# Altium project AMC_FMC_Carrier.PrjPcb (part 8 of 9)

## Sheet AMC-SATA.SchDoc
size A4; DocumentNumber: 25; SheetNumber: 25; SheetTotal: 30
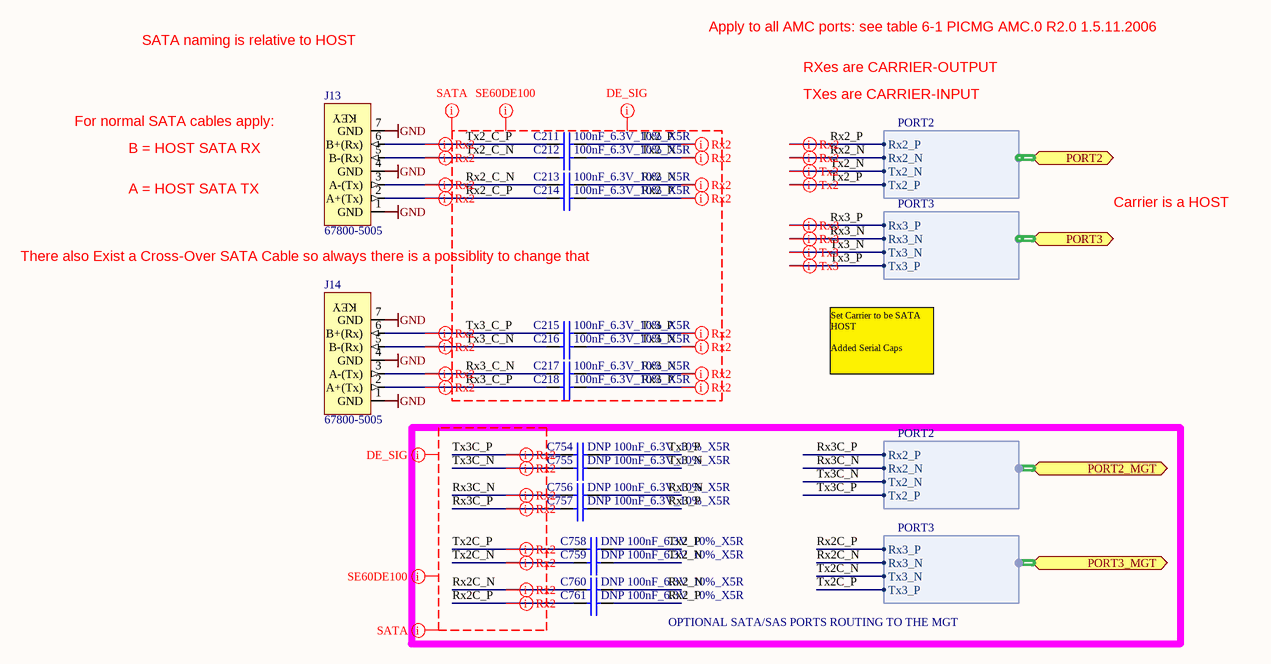
[diagram p20: AMC-SATA.SchDoc]

### Parts
C211  100nF_6.3V_10%_X5R  [0201C]
C212  100nF_6.3V_10%_X5R  [0201C]
C213  100nF_6.3V_10%_X5R  [0201C]
C214  100nF_6.3V_10%_X5R  [0201C]
C215  100nF_6.3V_10%_X5R  [0201C]
C216  100nF_6.3V_10%_X5R  [0201C]
C217  100nF_6.3V_10%_X5R  [0201C]
C218  100nF_6.3V_10%_X5R  [0201C]
C754  DNP 100nF_6.3V_10%_X5R  [0201C]
C755  DNP 100nF_6.3V_10%_X5R  [0201C]
C756  DNP 100nF_6.3V_10%_X5R  [0201C]
C757  DNP 100nF_6.3V_10%_X5R  [0201C]
C758  DNP 100nF_6.3V_10%_X5R  [0201C]
C759  DNP 100nF_6.3V_10%_X5R  [0201C]
C760  DNP 100nF_6.3V_10%_X5R  [0201C]
C761  DNP 100nF_6.3V_10%_X5R  [0201C]
J13  67800-5005  [CON_SATA_V]
J14  67800-5005  [CON_SATA_V]

### Blocks framed on the sheet
OPTIONAL SATA/SAS PORTS ROUTING TO THE MGT: C754-C761

### Ports
PORT2 (harness PORT2), PORT2_MGT (harness PORT2), PORT3 (harness PORT3), PORT3_MGT (harness PORT3)

### Harnesses
PORT2: Rx2_P, Rx2_N, Tx2_N, Tx2_P
PORT3: Rx3_P, Rx3_N, Tx3_N, Tx3_P

### Nets
GND: J13.1(GND) J13.4(GND) J13.7(GND) J14.1(GND) J14.4(GND) J14.7(GND)
Rx2_C_N: C213.1 J13.3(A-(Tx))
Rx2_C_P: C214.1 J13.2(A+(Tx))
Rx2_N: C213.2 C760.2 ; port PORT2.Rx2_N  [project net PORT2.Rx2_N]
Rx2_P: C214.2 C761.2 ; port PORT2.Rx2_P  [project net PORT2.Rx2_P]
Rx2C_N: C760.1 ; port PORT3_MGT.Rx3_N
Rx2C_P: C761.1 ; port PORT3_MGT.Rx3_P
Rx3_C_N: C217.1 J14.3(A-(Tx))
Rx3_C_P: C218.1 J14.2(A+(Tx))
Rx3_N: C217.2 C756.2 ; port PORT3.Rx3_N  [project net PORT3.Rx3_N]
Rx3_P: C218.2 C757.2 ; port PORT3.Rx3_P  [project net PORT3.Rx3_P]
Rx3C_N: C756.1 ; port PORT2_MGT.Rx2_N
Rx3C_P: C757.1 ; port PORT2_MGT.Rx2_P
Tx2_C_N: C212.1 J13.5(B-(Rx))
Tx2_C_P: C211.1 J13.6(B+(Rx))
Tx2_N: C212.2 C759.2 ; port PORT2.Tx2_N  [project net PORT2.Tx2_N]
Tx2_P: C211.2 C758.2 ; port PORT2.Tx2_P  [project net PORT2.Tx2_P]
Tx2C_N: C759.1 ; port PORT3_MGT.Tx3_N
Tx2C_P: C758.1 ; port PORT3_MGT.Tx3_P
Tx3_C_N: C216.1 J14.5(B-(Rx))
Tx3_C_P: C215.1 J14.6(B+(Rx))
Tx3_N: C216.2 C755.2 ; port PORT3.Tx3_N  [project net PORT3.Tx3_N]
Tx3_P: C215.2 C754.2 ; port PORT3.Tx3_P  [project net PORT3.Tx3_P]
Tx3C_N: C755.1 ; port PORT2_MGT.Tx2_N
Tx3C_P: C754.1 ; port PORT2_MGT.Tx2_P

### Layout directives
differential pair: PORT2.Rx2_N, PORT2.Rx2_P, PORT2.Tx2_N, PORT2.Tx2_P, PORT3.Rx3_N, PORT3.Rx3_P, PORT3.Tx3_N, PORT3.Tx3_P, Rx2_C_N, Rx2_C_P, Rx2C_N, Rx2C_P, Rx3_C_N, Rx3_C_P, Rx3C_N, Rx3C_P, Tx2_C_N, Tx2_C_P, Tx2C_N, Tx2C_P, Tx3_C_N, Tx3_C_P, Tx3C_N, Tx3C_P
net class SATA: Rx2_C_N, Rx2_C_P, Rx2_N, Rx2_P, Rx2C_N, Rx2C_P, Rx3_C_N, Rx3_C_P, Rx3_N, Rx3_P, Rx3C_N, Rx3C_P, Tx2_C_N, Tx2_C_P, Tx2_N, Tx2_P, Tx2C_N, Tx2C_P, Tx3_C_N, Tx3_C_P, Tx3_N, Tx3_P, Tx3C_N, Tx3C_P
net class SE60DE100: Rx2_C_N, Rx2_C_P, Rx2_N, Rx2_P, Rx2C_N, Rx2C_P, Rx3_C_N, Rx3_C_P, Rx3_N, Rx3_P, Rx3C_N, Rx3C_P, Tx2_C_N, Tx2_C_P, Tx2_N, Tx2_P, Tx2C_N, Tx2C_P, Tx3_C_N, Tx3_C_P, Tx3_N, Tx3_P, Tx3C_N, Tx3C_P
net class DE_SIG: Rx2_C_N, Rx2_C_P, Rx2_N, Rx2_P, Rx2C_N, Rx2C_P, Rx3_C_N, Rx3_C_P, Rx3_N, Rx3_P, Rx3C_N, Rx3C_P, Tx2_C_N, Tx2_C_P, Tx2_N, Tx2_P, Tx2C_N, Tx2C_P, Tx3_C_N, Tx3_C_P, Tx3_N, Tx3_P, Tx3C_N, Tx3C_P

### Notes on the sheet
- SATA naming is relative to HOST
- Apply to all AMC ports: see table 6-1 PICMG AMC.0 R2.0 1.5.11.2006
- RXes are CARRIER-OUTPUT
- For normal SATA cables apply:
- B = HOST SATA RX
- TXes are CARRIER-INPUT
- A = HOST SATA TX
- Carrier is a HOST
- There also Exist a Cross-Over SATA Cable so always there is a possiblity to change that
- Set Carrier to be SATA HOST
  Added Serial Caps
- (in symbol CON_SATA_V) KEY

### Library data of the parts
C211-C218 C754-C761 = CAP_SMD_0201: Capacitor SMD
J13 J14 = CON_SATA_V: SATA conenctor  PCB Molex

## Sheet block schematic.SchDoc
size A4; DocumentNumber: 15; SheetNumber: 15; SheetTotal: 30
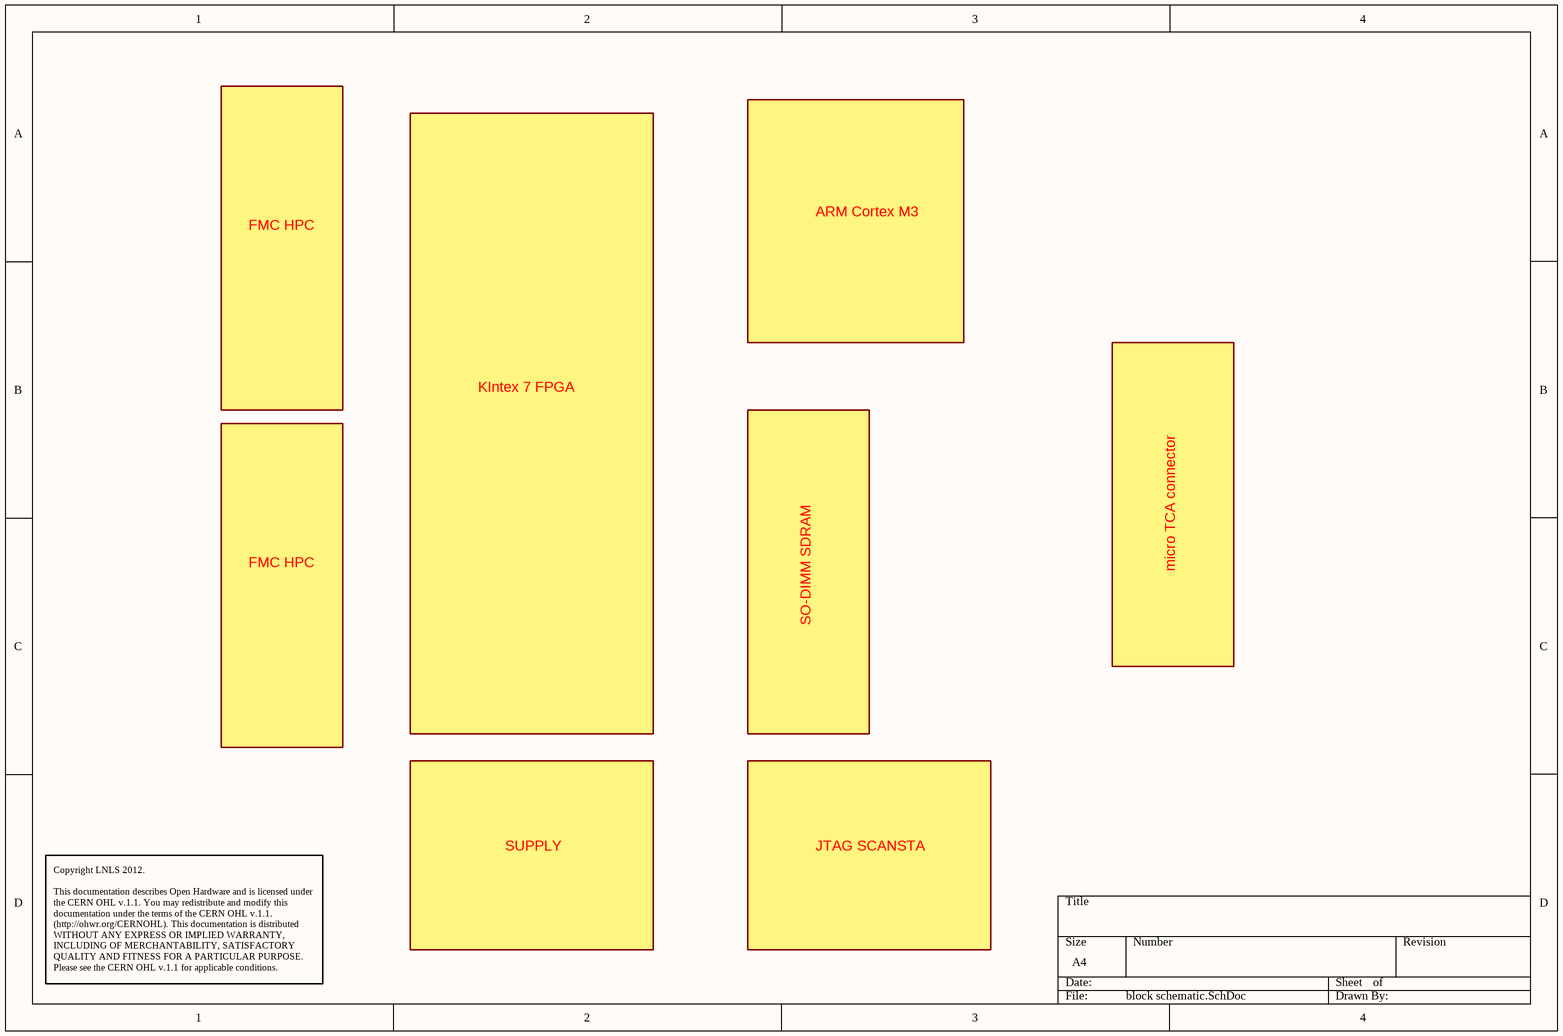
[diagram p21: block schematic.SchDoc]

### Notes on the sheet
- FMC HPC
- ARM Cortex M3
- KIntex 7 FPGA
- micro TCA connector
- SO-DIMM SDRAM
- SUPPLY
- JTAG SCANSTA
- Copyright LNLS 2012.
  This documentation describes Open Hardware and is licensed under the CERN OHL v.1.1. You may redistribute and modify this documentation under the terms of the CERN OHL v.1.1. (http://ohwr.org/CERNOHL). This documentation is distributed WITHOUT ANY EXPRESS OR IMPLIED WARRANTY, INCLUDING OF MERCHANTABILITY, SATISFACTORY QUALITY AND FITNESS FOR A PARTICULAR PURPOSE. Please see the CERN OHL v.1.1 for applicable conditions.

## Sheet HeightRuleRoom1.9mm.SchDoc
size A4
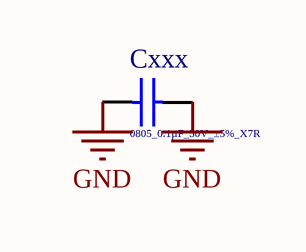
[diagram p22: HeightRuleRoom1.9mm.SchDoc]

### Parts
Cxxx  0805_0.1µF_50V_±5%_X7R  [CAPC2012X140N]

### Nets
GND: Cxxx.1 Cxxx.2

### Library data of the parts
Cxxx = 08055C104JAT2A: CAP CER 0.1UF 50V 5% X7R 0805; Manufacturer: AVX Corporation; Capacitance: 0.1µF; Document Name: HeightRuleRoom1.9mm.SchDoc; Part Number: 08055C104JAT2A; ParamsList: 0805_0.1µF_50V_±5%_X7R; Supplier 1: Digi-Key; Supplier Part Number 1: 478-3352-1-ND; Manufacturer Part Number: 08055C104JAT2A; RoHS: RoHS Compliant; Category: Capacitors; Stock 1: 277543; Pricing 1: 1=0.15, 10=0.1, 100=0.0475, 250=0.04, 500=0.0335, 1000=0.0275 (USD); Voltage - Rated: 50V; Tolerance: ±5%; Temperature Coefficient: X7R; Mounting Type: Surface Mount, MLCC; Operating Temperature: -55°C ~ 125°C; Applications: General Purpose; Ratings: -; Package / Case: 0805 (2012 Metric); Size / Dimension: 0.079" L x 0.049" W (2.01mm x 1.25mm); Height - Seated (Max): -; Thickness (Max): 0.055" (1.40mm); Lead Spacing: -; Features: -; Packaging: Cut Tape (CT); Lead Style: -; ComponentLink1URL: http://www.avx.com/docs/Catalogs/cx7r.pdf; ComponentLink1Description: http://www.avx.com/docs/Catalogs/cx7r.pdf; FootprintSizeX (mm): 3.5; FootprintSizeY (mm): 2; FootprintRectangleArea (mm): 7; Thickness (Max) (mm): 1.4; FootprintAlias: 0805

## Sheet SUP_1.2_1.8.SchDoc
size A4; DocumentNumber: 6; SheetNumber: 6; SheetTotal: 30
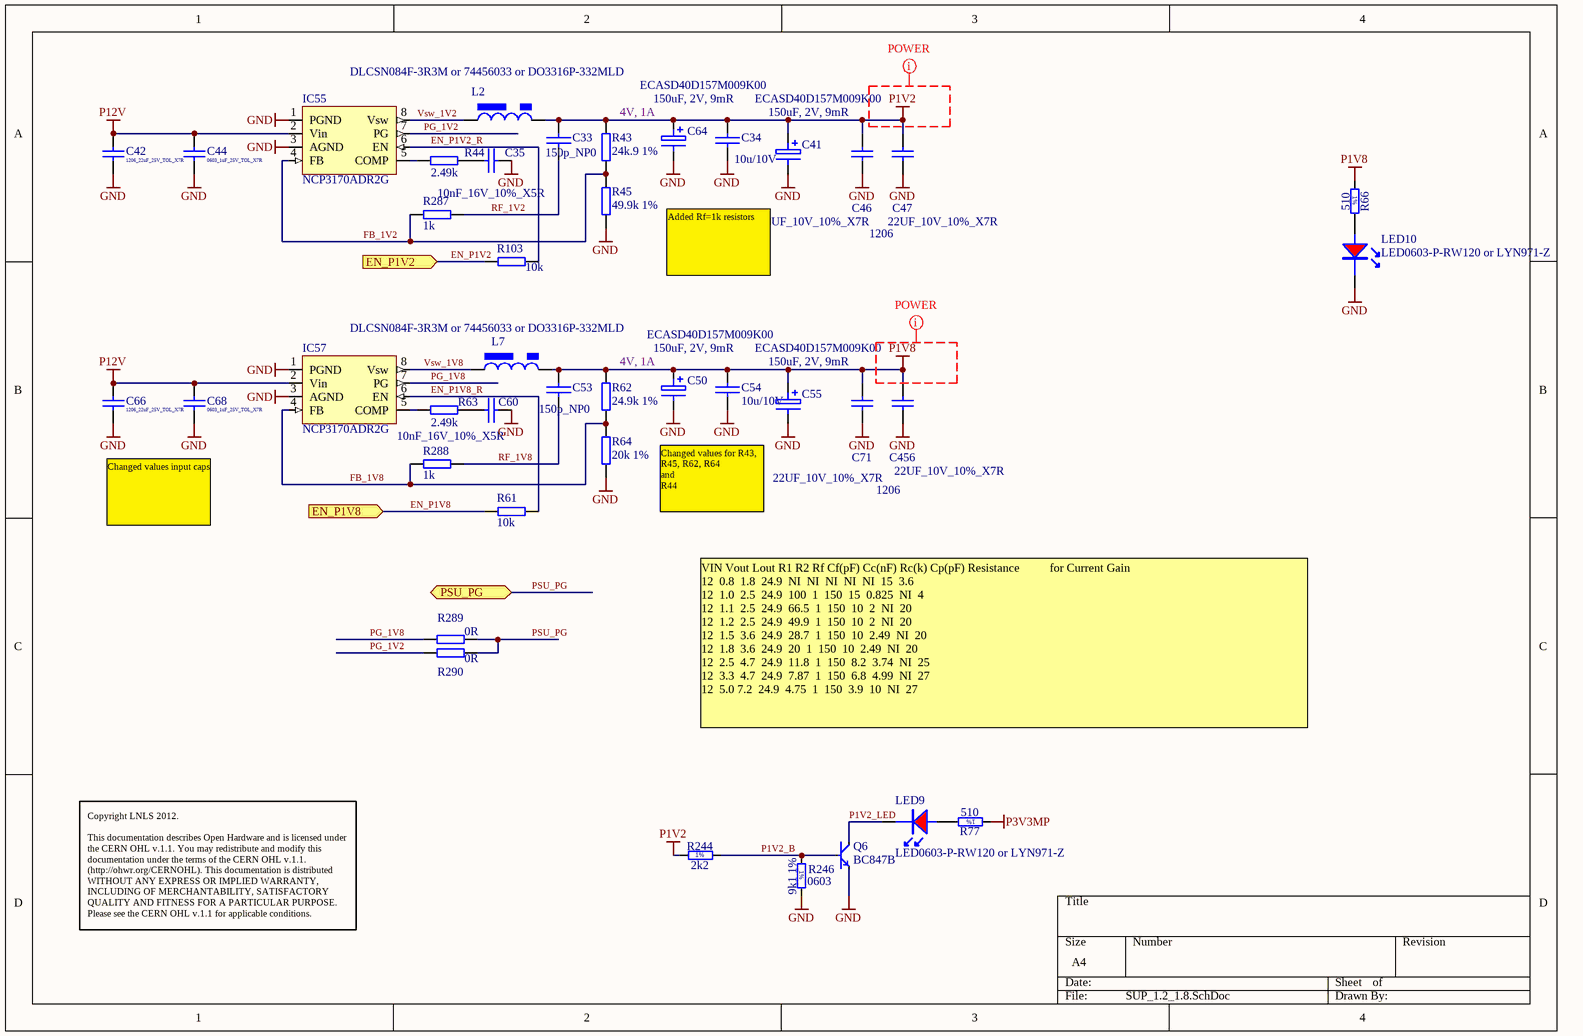
[diagram p23: SUP_1.2_1.8.SchDoc]

### Parts
C33  150p_NP0  [0603C]
C34  10u/10V  [0805C]
C35  10nF_16V_10%_X5R  [0603C]
C41  ECASD40D157M009K00  value 150uF, 2V, 9mR  [2917_POLY]
C42  1206_22uF_25V_TOL_X7R  [CAPC3225X140N]
C44  0603_1uF_25V_TOL_X7R  [CAPC1608X90N]
C46  22UF_10V_10%_X7R  [1206C]
C47  22UF_10V_10%_X7R  Case: 1206  [1206C]
C50  ECASD40D157M009K00  value 150uF, 2V, 9mR  [2917_POLY]
C53  150p_NP0  [0603C]
C54  10u/10V  [0805C]
C55  ECASD40D157M009K00  value 150uF, 2V, 9mR  [2917_POLY]
C60  10nF_16V_10%_X5R  [0603C]
C64  ECASD40D157M009K00  value 150uF, 2V, 9mR  [2917_POLY]
C66  1206_22uF_25V_TOL_X7R  [CAPC3225X140N]
C68  0603_1uF_25V_TOL_X7R  [CAPC1608X90N]
C71  22UF_10V_10%_X7R  [1206C]
C456  22UF_10V_10%_X7R  Case: 1206  [1206C]
IC55  NCP3170ADR2G  [so-8]
IC57  NCP3170ADR2G  [so-8]
L2  DLCSN084F-3R3M or 74456033 or DO3316P-332MLD  [IND_CSN084F]
L7  DLCSN084F-3R3M or 74456033 or DO3316P-332MLD  [IND_CSN084F]
LED9  LED0603-P-RW120 or LYN971-Z  [led_0603R]
LED10  LED0603-P-RW120 or LYN971-Z  [led_0603R]
Q6  BC847B  [SOT-23]
R43  24k.9 1%  [0603R]
R44  2.49k  [0603R]
R45  49.9k 1%  [0603R]
R61  10k  [0402R]
R62  24.9k 1%  [0603R]
R63  2.49k  [0603R]
R64  20k 1%  [0603R]
R66  510  [0603R]
R77  510  [0603R]
R103  10k  [0402R]
R244  2k2  [RESC1608X55N]
R246  9k1 1%  Case: 0603  [0603R]
R287  1k  [0603R]
R288  1k  [0603R]
R289  0R  [0402R]
R290  0R  [0402R]

### Ports
EN_P1V2 (in), EN_P1V8 (in), PSU_PG

### Nets
GND: C34.2 C35.2 C41.2 C42.1 C44.1 C46.2 C47.2 C50.2 C54.2 C55.2 C60.2 C64.2 C66.1 C68.1 C71.2 C456.2 IC55.1(PGND) IC55.3(AGND) IC57.1(PGND) IC57.3(AGND) LED10.K Q6.2(E) R45.1 R64.1 R246.2
P1V2: C33.1 C34.1 C41.1 C46.1 C47.1 C64.1 L2.2 R43.2 R244.1
P1V8: C50.1 C53.1 C54.1 C55.1 C71.1 C456.1 L7.2 R62.2 R66.1
P3V3MP: R77.1
P12V: C42.2 C44.2 C66.2 C68.2 IC55.2(Vin) IC57.2(Vin)
EN_P1V2: R103.1 ; port EN_P1V2
EN_P1V2_R: IC55.6(EN) R103.2
EN_P1V8: R61.1 ; port EN_P1V8
EN_P1V8_R: IC57.6(EN) R61.2
FB_1V2: IC55.4(FB) R43.1 R45.2 R287.2
FB_1V8: IC57.4(FB) R62.1 R64.2 R288.2
P1V2_B: Q6.1(B) R244.2 R246.1
P1V2_LED: LED9.K Q6.3(C)
PG_1V2: IC55.7(PG) R290.2
PG_1V8: IC57.7(PG) R289.2
PSU_PG: R289.1 R290.1 ; port PSU_PG
RF_1V2: C33.2 R287.1
RF_1V8: C53.2 R288.1
Vsw_1V2: IC55.8(Vsw) L2.1
Vsw_1V8: IC57.8(Vsw) L7.1
NetC35_1: C35.1 R44.1
NetC60_1: C60.1 R63.1
NetIC55_5: IC55.5(COMP) R44.2
NetIC57_5: IC57.5(COMP) R63.2
NetLED9_A: LED9.A R77.2
NetLED10_A: LED10.A R66.2

### Layout directives
net class POWER: P1V2, P1V8

### Notes on the sheet
- 4V, 1A
- Added Rf=1k resistors
- Changed values input caps
- Changed values for R43, R45, R62, R64
  and
  R44
- VIN	Vout	Lout	R1	R2	Rf	Cf(pF)	Cc(nF)	Rc(k)	Cp(pF) Resistance 									for Current Gain
  12 	0.8 	1.8 	24.9 	NI 	NI 	NI 	NI 	NI 	15 	3.6
  12 	1.0 	2.5 	24.9 	100 	1 	150 	15 	0.825 	NI 	4
  12 	1.1 	2.5 	24.9 	66.5 	1 	150 	10 	2 	NI 	20
  12 	1.2 	2.5 	24.9 	49.9 	1 	150 	10 	2 	NI 	20
  12 	1.5 	3.6 	24.9 	28.7 	1 	150 	10 	2.49 	NI 	20
  12 	1.8 	3.6 	24.9 	20 	1 	150 	10 	2.49 	NI 	20
  12 	2.5 	4.7 	24.9 	11.8 	1 	150 	8.2 	3.74 	NI 	25
  12 	3.3 	4.7 	24.9 	7.87 	1 	150 	6.8 	4.99 	NI 	27
  12 	5.0	7.2 	24.9 	4.75 	1 	150 	3.9 	10 	NI 	27
- Copyright LNLS 2012.
  This documentation describes Open Hardware and is licensed under the CERN OHL v.1.1. You may redistribute and modify this documentation under the terms of the CERN OHL v.1.1. (http://ohwr.org/CERNOHL). This documentation is distributed WITHOUT ANY EXPRESS OR IMPLIED WARRANTY, INCLUDING OF MERCHANTABILITY, SATISFACTORY QUALITY AND FITNESS FOR A PARTICULAR PURPOSE. Please see the CERN OHL v.1.1 for applicable conditions.
- (in symbol R0402_510R_1%_0.0625W_100PPM) 1%
- (in symbol R0603_2K2_1%_0.1W_100PPM) 1%
- (in symbol R0603_9K1_1%_0.1W_100PPM) 1%

### Library data of the parts
C33 C35 C53 C60 = CAP_SMD_0603: Capacitor SMD
C34 C54 = CAP_SMD_0805: Capacitor SMD; Supplier 1: Farnell; Supplier Part Number 1: 1833812
C41 C50 C55 C64 = CAP_POLYMER: POLY, 150uF, 2V, ESR: 9mR
C42 C66 = Ceramic_1206: MiscInfo: Biggest Cern Footprint [max height]; Document Name: SUP_1.2_1.8.SchDoc; Part Number: Ceramic_1206; FootprintSizeX (mm): 4.65; FootprintSizeY (mm): 2.3; FootprintRectangleArea (mm): 10.7; Thickness (Max) (mm): 1.8; FootprintAlias: 1206
C44 C68 = Ceramic_0603: MiscInfo: Biggest Cern Footprint [max height]; Document Name: SUP_1.2_1.8.SchDoc; Part Number: Ceramic_0603; FootprintSizeX (mm): 3; FootprintSizeY (mm): 1.5; FootprintRectangleArea (mm): 4.5; Thickness (Max) (mm): 0.9; FootprintAlias: 0603
C46 C47 C71 C456 = CC1206_22UF_10V_10%_X7R: as C419 on sheet Clock_WR; Part Number: CC1206_22UF_10V_10%_X7R; Component Kind: Standard; Component Type: Standard; Footprint: CAPC3216X180N; Pin Count: 2; Status: Preferred; Manufacturer Part Number: CC1206_22UF_10V_10%_X7R; Mounted: Yes; Socket: No; SMD: Yes; Manufacturer1 Example: MURATA; Manufacturer1 ComponentHeight: 1.8mm; HelpURL: \\cern.ch\dfs\Applications\Altium\Datasheets\CC1206_X7R_MURATA_GRM-HI-CAP.pdf; Author: CERN DEM JLC; CreateDate: 08/06/2010; LatestRevisionDate: 08/06/2010
IC55 IC57 = PWM_NCP3170: 4.5V to 18V, 3A synch buck
L2 L7 = L_POWER_CSN084F_3R3: 3.3uH, 20%, 5.4A, 0.015R
LED9 LED10 = LED_0603R: LED 0603 red; Supplier 1: Newark; Supplier Part Number 1: 22M3004; Supplier 2: Newark; Supplier Part Number 2: 20M0618
Q6 = Q_BC847B: Transistor
R43-R45 R62-R64 R287 R288 = RES_0603: SMD Resistor
R61 R103 = RES_SMD: SMD Resistor
R66 R77 = R0402_510R_1%_0.0625W_100PPM: Resistor - 1%; Part Description: General Purpose Thick Film Chip Resistor; Manufacturer: GENERIC; Manufacturer1 Part Number: 232270675101; TC: ±100ppm/°C; Table: Resistors SMD; Part Number: R0402_510R_1%_0.0625W_100PPM; Component Kind: Standard; Component Type: Standard; Footprint: RESC1005X40N; Pin Count: 2; Value: 510; Status: Not recommended; Power: 0.0625W; Tolerance: ±1%; Manufacturer Part Number: R0402_510R_1%_0.0625W_100PPM; Case: 0402; Mounted: Yes; Socket: No; SMD: Yes; Manufacturer1 Example: PHYCOMP; Manufacturer1 ComponentHeight: 0.4mm; HelpURL: \\cern.ch\dfs\Applications\Altium\Datasheets\R0402_Phycomp_RC0402.pdf; Author: CERN DEM JLC; CreateDate: 2007-12-03; LatestRevisionDate: 2008-03-13
R244 = R0603_2K2_1%_0.1W_100PPM: Resistor - 1%; Part Description: General Purpose Thick Film Chip Resistor; Manufacturer: GENERIC; Manufacturer1 Part Number: NRC06F2201TRF; Power: 0.1W; TC: ±100ppm/°C; Table: Resistors SMD; Part Number: R0603_2K2_1%_0.1W_100PPM; Component Kind: Standard; Component Type: Standard; Pin Count: 2; Value: 2k2; Status: Preferred; Tolerance: ±1%; Manufacturer Part Number: R0603_2K2_1%_0.1W_100PPM; Case: 0603; Mounted: Yes; Socket: No; SMD: Yes; Manufacturer1 Example: NIC COMPONENT; Manufacturer1 ComponentHeight: 0.55mm; HelpURL: \\cern.ch\dfs\Applications\Altium\Datasheets\R0603_NIC_NRC.pdf; Author: CERN DEM JLC; CreateDate: 2007-12-03; LatestRevisionDate: 2008-03-13
R246 = R0603_9K1_1%_0.1W_100PPM: Resistor - 1%; Part Description: General Purpose Thick Film Chip Resistor; Manufacturer: GENERIC; Manufacturer1 Part Number: NRC06F9101TRF; Power: 0.1W; TC: ±100ppm/°C; Table: Resistors SMD; Part Number: R0603_9K1_1%_0.1W_100PPM; Component Kind: Standard; Component Type: Standard; Footprint: RESC1608X55N; Pin Count: 2; Value: 9k1; Status: Preferred; Tolerance: ±1%; Manufacturer Part Number: R0603_9K1_1%_0.1W_100PPM; Mounted: Yes; Socket: No; SMD: Yes; Manufacturer1 Example: NIC COMPONENT; Manufacturer1 ComponentHeight: 0.55mm; HelpURL: \\cern.ch\dfs\Applications\Altium\Datasheets\R0603_NIC_NRC.pdf; Author: CERN DEM JLC; CreateDate: 2007-12-03; LatestRevisionDate: 2008-03-13
R289 R290 = RES_0402: SMD Resistor; Supplier 1: Newark; Supplier Part Number 1: 59M6691

## Sheet SUP_3.3_FMC.SchDoc
size A4; DocumentNumber: 7; SheetNumber: 7; SheetTotal: 30
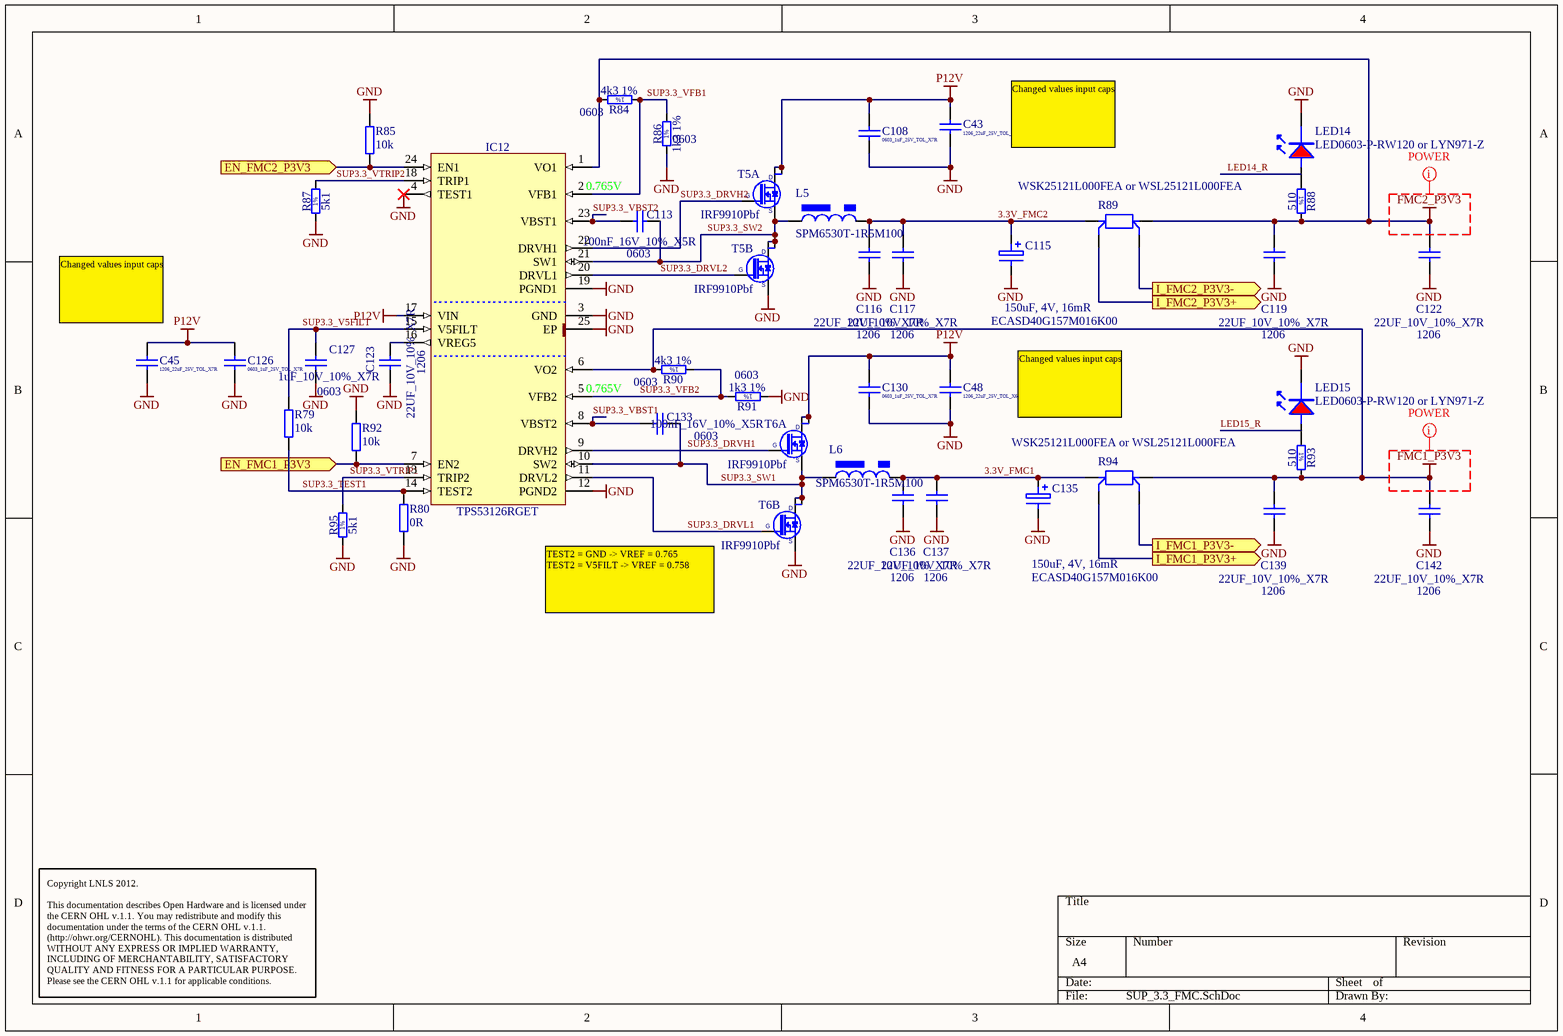
[diagram p24: SUP_3.3_FMC.SchDoc]

### Parts
C43  1206_22uF_25V_TOL_X6S  [CAPC3225X140N]
C45  1206_22uF_25V_TOL_X7R  [CAPC3225X140N]
C48  1206_22uF_25V_TOL_X6S  [CAPC3225X140N]
C108  0603_1uF_25V_TOL_X7R  [CAPC1608X90N]
C113  100nF_16V_10%_X5R  Case: 0603  [0402C]
C115  ECASD40G157M016K00  value 150uF, 4V, 16mR  [2917_POLY]
C116  22UF_10V_10%_X7R  Case: 1206  [1206C]
C117  22UF_10V_10%_X7R  Case: 1206  [1206C]
C119  22UF_10V_10%_X7R  Case: 1206  [1206C]
C122  22UF_10V_10%_X7R  Case: 1206  [1206C]
C123  22UF_10V_10%_X7R  Case: 1206  [1206C]
C126  0603_1uF_25V_TOL_X7R  [CAPC1608X90N]
C127  1uF_10V_10%_X7R  Case: 0603  [0603C]
C130  0603_1uF_25V_TOL_X7R  [CAPC1608X90N]
C133  100nF_16V_10%_X5R  Case: 0603  [0402C]
C135  ECASD40G157M016K00  value 150uF, 4V, 16mR  [2917_POLY]
C136  22UF_10V_10%_X7R  Case: 1206  [1206C]
C137  22UF_10V_10%_X7R  Case: 1206  [1206C]
C139  22UF_10V_10%_X7R  Case: 1206  [1206C]
C142  22UF_10V_10%_X7R  Case: 1206  [1206C]
IC12  TPS53126RGET  [QFN50P400X400X100-25N-S255]
L5  SPM6530T-1R5M100  [IND_TDK_SPM6530]
L6  SPM6530T-1R5M100  [IND_TDK_SPM6530]
LED14  LED0603-P-RW120 or LYN971-Z  [led_0603R]
LED15  LED0603-P-RW120 or LYN971-Z  [led_0603R]
R79  10k  [0402R]
R80  0R  [0402R]
R84  4k3 1%  Case: 0603  [0603R]
R85  10k  [0402R]
R86  1k3 1%  Case: 0603  [0603R]
R87  5k1  [0603R]
R88  510  [0603R]
R89  WSK25121L000FEA or WSL25121L000FEA  [RES_WSK2512]
R90  4k3 1%  Case: 0603  [0603R]
R91  1k3 1%  Case: 0603  [0603R]
R92  10k  [0402R]
R93  510  [0603R]
R94  WSK25121L000FEA or WSL25121L000FEA  [RES_WSK2512]
R95  5k1  [0603R]
T5  IRF9910Pbf  [SOIC127P600X175-8N]  (parts A,B of 2)
T6  IRF9910Pbf  [SOIC127P600X175-8N]  (parts A,B of 2)

### Ports
EN_FMC1_P3V3 (in), EN_FMC2_P3V3 (in), I_FMC1_P3V3+ (out), I_FMC1_P3V3- (out), I_FMC2_P3V3+ (out), I_FMC2_P3V3- (out)

### Nets
FMC1_P3V3: C139.1 C142.1 IC12.6(VO2) R90.2 R93.2 R94.2
FMC2_P3V3: C119.1 C122.1 IC12.1(VO1) R84.2 R88.2 R89.2
GND: C43.1 C45.1 C48.1 C108.1 C115.2 C116.2 C117.2 C119.2 C122.2 C123.1 C126.1 C127.1 C130.1 C135.2 C136.2 C137.2 C139.2 C142.2 IC12.3(GND) IC12.4(TEST1) IC12.12(PGND2) IC12.19(PGND1) IC12.25(EP) LED14.K LED15.K R80.1 R85.2 R86.1 R87.1 R91.1 R92.2 R95.1 T5.1(S) T6.1(S)
P12V: C43.2 C45.2 C48.2 C108.2 C126.2 C130.2 IC12.17(VIN) T5.5(D) T5.6(D) T6.5(D) T6.6(D)
3.3V_FMC1: C135.1 C136.1 C137.1 L6.2 R94.1
3.3V_FMC2: C115.1 C116.1 C117.1 L5.2 R89.1
SUP3.3_DRVH1: IC12.9(DRVH2) T6.4(G)
SUP3.3_DRVH2: IC12.22(DRVH1) T5.4(G)
SUP3.3_DRVL1: IC12.11(DRVL2) T6.2(G)
SUP3.3_DRVL2: IC12.20(DRVL1) T5.2(G)
SUP3.3_SW1: C133.1 IC12.10(SW2) L6.1 T6.3(S) T6.7(D) T6.8(D)
SUP3.3_SW2: C113.1 IC12.21(SW1) L5.1 T5.3(S) T5.7(D) T5.8(D)
SUP3.3_TEST1: IC12.14(TEST2) R79.1 R80.2
SUP3.3_V5FILT: C127.2 IC12.15(V5FILT) R79.2
SUP3.3_VBST1: C133.2 IC12.8(VBST2)
SUP3.3_VBST2: C113.2 IC12.23(VBST1)
SUP3.3_VFB1: IC12.2(VFB1) R84.1 R86.2
SUP3.3_VFB2: IC12.5(VFB2) R90.1 R91.2
SUP3.3_VTRIP1: IC12.13(TRIP2) R95.2
SUP3.3_VTRIP2: IC12.18(TRIP1) R87.2
NetC123_2: C123.2 IC12.16(VREG5)
NetIC12_7: IC12.7(EN2) R92.1 ; port EN_FMC1_P3V3
NetIC12_24: IC12.24(EN1) R85.1 ; port EN_FMC2_P3V3
NetLED14_A: LED14.A R88.1
NetLED15_A: LED15.A R93.1
NetR89_1a: R89.1a ; port I_FMC2_P3V3+
NetR89_2a: R89.2a ; port I_FMC2_P3V3-
NetR94_1a: R94.1a ; port I_FMC1_P3V3+
NetR94_2a: R94.2a ; port I_FMC1_P3V3-

### Layout directives
net class POWER: FMC1_P3V3, FMC2_P3V3

### Notes on the sheet
- Changed values input caps
- 0.765V
- (near C45) Changed values input caps
- (near IC12) 0.765V
- TEST2 = GND -> VREF = 0.765
  TEST2 = V5FILT -> VREF = 0.758
- Copyright LNLS 2012.
  This documentation describes Open Hardware and is licensed under the CERN OHL v.1.1. You may redistribute and modify this documentation under the terms of the CERN OHL v.1.1. (http://ohwr.org/CERNOHL). This documentation is distributed WITHOUT ANY EXPRESS OR IMPLIED WARRANTY, INCLUDING OF MERCHANTABILITY, SATISFACTORY QUALITY AND FITNESS FOR A PARTICULAR PURPOSE. Please see the CERN OHL v.1.1 for applicable conditions.
- (in symbol R0402_510R_1%_0.0625W_100PPM) 1%
- (in symbol R0603_1K3_1%_0.1W_100PPM) 1%
- (in symbol R0603_4K3_1%_0.1W_100PPM) 1%
- (in symbol R0603_5K1_1%_0.1W_100PPM) 1%

### Library data of the parts
C43 C45 C48 = Ceramic_1206: MiscInfo: Biggest Cern Footprint [max height]; Document Name: SUP_3.3_FMC.SchDoc; Part Number: Ceramic_1206; FootprintSizeX (mm): 4.65; FootprintSizeY (mm): 2.3; FootprintRectangleArea (mm): 10.7; Thickness (Max) (mm): 1.8; FootprintAlias: 1206
C108 C126 C130 = Ceramic_0603: MiscInfo: Biggest Cern Footprint [max height]; Document Name: SUP_3.3_FMC.SchDoc; Part Number: Ceramic_0603; FootprintSizeX (mm): 3; FootprintSizeY (mm): 1.5; FootprintRectangleArea (mm): 4.5; Thickness (Max) (mm): 0.9; FootprintAlias: 0603
C113 C133 = CC0603_100NF_50V_10%_X7R: Non-polarised capacitor; Part Description: SMD Multilayer Chip Ceramic Capacitor; Manufacturer: GENERIC; Manufacturer1 Part Number: 223858615649; Value: 100nF; Voltage: 50V; TC: X7R; Tolerance: ±10%; Table: Capacitors SMD; Part Number: CC0603_100NF_50V_10%_X7R; Component Kind: Standard; Component Type: Standard; Footprint: CAPC1608X87N; Pin Count: 2; Status: Preferred; Manufacturer Part Number: CC0603_100NF_50V_10%_X7R; Mounted: Yes; Socket: No; SMD: Yes; Manufacturer1 Example: PHYCOMP; Manufacturer1 ComponentHeight: 0.87mm; HelpURL: \\cern.ch\dfs\Applications\Altium\Datasheets\CC0603_X7R_PHYCOMP.pdf; Author: CERN DEM JLC; CreateDate: 2007-12-03; LatestRevisionDate: 2007-12-03
C115 C135 = CAP_POLYMER_SMDD: POLY, 150uF, 4V, ESR: 16mR
C116 C117 C119 C122 C123 C136 C137 C139 C142 = CC1206_22UF_10V_10%_X7R: Non-polarised capacitor; Part Description: SMD Multilayer Chip Ceramic Capacitor; Manufacturer: GENERIC; Manufacturer1 Part Number: GRM31CR71A226KE15L; Value: 22uF; Voltage: 10V; TC: X7R; Tolerance: ±10%; Table: Capacitors SMD; Part Number: CC1206_22UF_10V_10%_X7R; Component Kind: Standard; Component Type: Standard; Footprint: CAPC3216X180N; Pin Count: 2; Status: Preferred; Manufacturer Part Number: CC1206_22UF_10V_10%_X7R; Mounted: Yes; Socket: No; SMD: Yes; Manufacturer1 Example: MURATA; Manufacturer1 ComponentHeight: 1.8mm; HelpURL: \\cern.ch\dfs\Applications\Altium\Datasheets\CC1206_X7R_MURATA_GRM-HI-CAP.pdf; Author: CERN DEM JLC; CreateDate: 08/06/2010; LatestRevisionDate: 08/06/2010
C127 = CC0603_1UF_16V_10%_X7R: Non-polarised capacitor; Part Description: SMD Multilayer Chip Ceramic Capacitor; Manufacturer: GENERIC; Manufacturer1 Part Number: 223824613663; Value: 1uF; Voltage: 16V; TC: X7R; Tolerance: ±10%; Table: Capacitors SMD; Part Number: CC0603_1UF_16V_10%_X7R; Component Kind: Standard; Component Type: Standard; Footprint: CAPC1608X87N; Pin Count: 2; Status: Preferred; Manufacturer Part Number: CC0603_1uF_16V_10%_X7R; Mounted: Yes; Socket: No; SMD: Yes; Manufacturer1 Example: PHYCOMP; Manufacturer1 ComponentHeight: 0.87mm; HelpURL: \\cern.ch\dfs\Applications\Altium\Datasheets\CC0805_X5R_PHYCOMP_HC.pdf; Author: CERN DEM JLC; CreateDate: 03/12/2007; LatestRevisionDate: 03/12/2007
IC12 = TPS53126RGET: Dual Synchronous Step-Down Controller For Low Voltage Power Rails; Manufacturer: TEXAS INSTRUMENTS; Table: Analog & Interface; Part Number: TPS53126RGET; Component Kind: Standard; Component Type: Standard; Device: TPS53126RGET; PackageDescription: QFN,0.50mm pitch,square;6 pin X 6 pin,4.15mm X 4.15mm X 1.00mm H body (w/thermal tab 2.55 X 2.55mm),  IPC Medium Density; Part Description: Dual Synchronous Step-Down Controller For Low Voltage Power Rails; Manufacturer Part Number: TPS53126RGET; Pin Count: 25; Case: QFN24; Mounted: Yes; Socket: No; SMD: Yes; ComponentHeight: 1.0mm; Author: CERN DEM JLC; HelpURL: \\cern.ch\dfs\Applications\Altium\Datasheets\TPS53126RGET.pdf; CreateDate: 2010-08-26; LatestRevisionDate: 2010-08-26
L5 L6 = L_POWER_SPM6530T: 1.5uH, 20%, 10mR, 11.5A; Supplier 1: Arrow; Supplier Part Number 1: 51419938S48550N1165
LED14 LED15 = LED_0603R: LED 0603 red; Supplier 1: Newark; Supplier Part Number 1: 22M3004; Supplier 2: Newark; Supplier Part Number 2: 20M0618
R79 R80 R85 R92 = RES_0402: SMD Resistor; Supplier 1: Newark; Supplier Part Number 1: 59M6691
R84 R90 = R0603_4K3_1%_0.1W_100PPM: Resistor - 1%; Part Description: General Purpose Thick Film Chip Resistor; Manufacturer: GENERIC; Manufacturer1 Part Number: NRC06F4301TRF; Power: 0.1W; TC: ±100ppm/°C; Table: Resistors SMD; Part Number: R0603_4K3_1%_0.1W_100PPM; Component Kind: Standard; Component Type: Standard; Footprint: RESC1608X55N; Pin Count: 2; Value: 4k3; Status: Preferred; Tolerance: ±1%; Manufacturer Part Number: R0603_4K3_1%_0.1W_100PPM; Mounted: Yes; Socket: No; SMD: Yes; Manufacturer1 Example: NIC COMPONENT; Manufacturer1 ComponentHeight: 0.55mm; HelpURL: \\cern.ch\dfs\Applications\Altium\Datasheets\R0603_NIC_NRC.pdf; Author: CERN DEM JLC; CreateDate: 2007-12-03; LatestRevisionDate: 2008-03-13
R86 R91 = R0603_1K3_1%_0.1W_100PPM: Resistor - 1%; Part Description: General Purpose Thick Film Chip Resistor; Manufacturer: GENERIC; Manufacturer1 Part Number: NRC06F1301TRF; Power: 0.1W; TC: ±100ppm/°C; Table: Resistors SMD; Part Number: R0603_1K3_1%_0.1W_100PPM; Component Kind: Standard; Component Type: Standard; Footprint: RESC1608X55N; Pin Count: 2; Value: 1k3; Status: Preferred; Tolerance: ±1%; Manufacturer Part Number: R0603_1K3_1%_0.1W_100PPM; Mounted: Yes; Socket: No; SMD: Yes; Manufacturer1 Example: NIC COMPONENT; Manufacturer1 ComponentHeight: 0.55mm; HelpURL: \\cern.ch\dfs\Applications\Altium\Datasheets\R0603_NIC_NRC.pdf; Author: CERN DEM JLC; CreateDate: 2007-12-03; LatestRevisionDate: 2008-03-13
R87 R95 = R0603_5K1_1%_0.1W_100PPM: Resistor - 1%; Part Description: General Purpose Thick Film Chip Resistor; Manufacturer: GENERIC; Manufacturer1 Part Number: NRC06F5101TRF; Power: 0.1W; TC: ±100ppm/°C; Table: Resistors SMD; Part Number: R0603_5K1_1%_0.1W_100PPM; Component Kind: Standard; Component Type: Standard; Footprint: RESC1608X55N; Pin Count: 2; Value: 5k1; Status: Preferred; Tolerance: ±1%; Manufacturer Part Number: R0603_5K1_1%_0.1W_100PPM; Case: 0603; Mounted: Yes; Socket: No; SMD: Yes; Manufacturer1 Example: NIC COMPONENT; Manufacturer1 ComponentHeight: 0.55mm; HelpURL: \\cern.ch\dfs\Applications\Altium\Datasheets\R0603_NIC_NRC.pdf; Author: CERN DEM JLC; CreateDate: 2007-12-03; LatestRevisionDate: 2008-03-13
R88 R93 = R0402_510R_1%_0.0625W_100PPM: Resistor - 1%; Part Description: General Purpose Thick Film Chip Resistor; Manufacturer: GENERIC; Manufacturer1 Part Number: 232270675101; TC: ±100ppm/°C; Table: Resistors SMD; Part Number: R0402_510R_1%_0.0625W_100PPM; Component Kind: Standard; Component Type: Standard; Footprint: RESC1005X40N; Pin Count: 2; Value: 510; Status: Not recommended; Power: 0.0625W; Tolerance: ±1%; Manufacturer Part Number: R0402_510R_1%_0.0625W_100PPM; Case: 0402; Mounted: Yes; Socket: No; SMD: Yes; Manufacturer1 Example: PHYCOMP; Manufacturer1 ComponentHeight: 0.4mm; HelpURL: \\cern.ch\dfs\Applications\Altium\Datasheets\R0402_Phycomp_RC0402.pdf; Author: CERN DEM JLC; CreateDate: 2007-12-03; LatestRevisionDate: 2008-03-13
R89 R94 = RES_POW_Kelvin: RESISTOR, METAL STRIP, 0.001 OHM 1%
T5 T6 = IRF9910Pbf: Dual SO-8 MOSFET For POL Cconverter; Part Description: 20V 10A(Q1) 20V 12A (Q2) Dual SO-8 MOSFET For POL Cconverter; Manufacturer: INTERNATIONAL RECTIFIER; Table: Transistors; Part Number: IRF9910Pbf; Component Kind: Standard; Component Type: Standard; Device: IRF9910Pbf; PackageDescription: SOIC 8, Pitch 1.27mm - Body 4x5mm, IPC Medium Density; Manufacturer Part Number: IRF9910Pbf; Pin Count: 8; Case: DO8; Mounted: Yes; Socket: No; SMD: Yes; ComponentHeight: 1.75mm; HelpURL: \\cern.ch\dfs\Applications\Altium\Datasheets\IRF9910Pbf.pdf; Author: CERN DEM JLC; CreateDate: 2010-08-30; LatestRevisionDate: 2010-08-30

## Sheet SUP_1V.SchDoc
size A4; DocumentNumber: 14; SheetNumber: 14; SheetTotal: 30
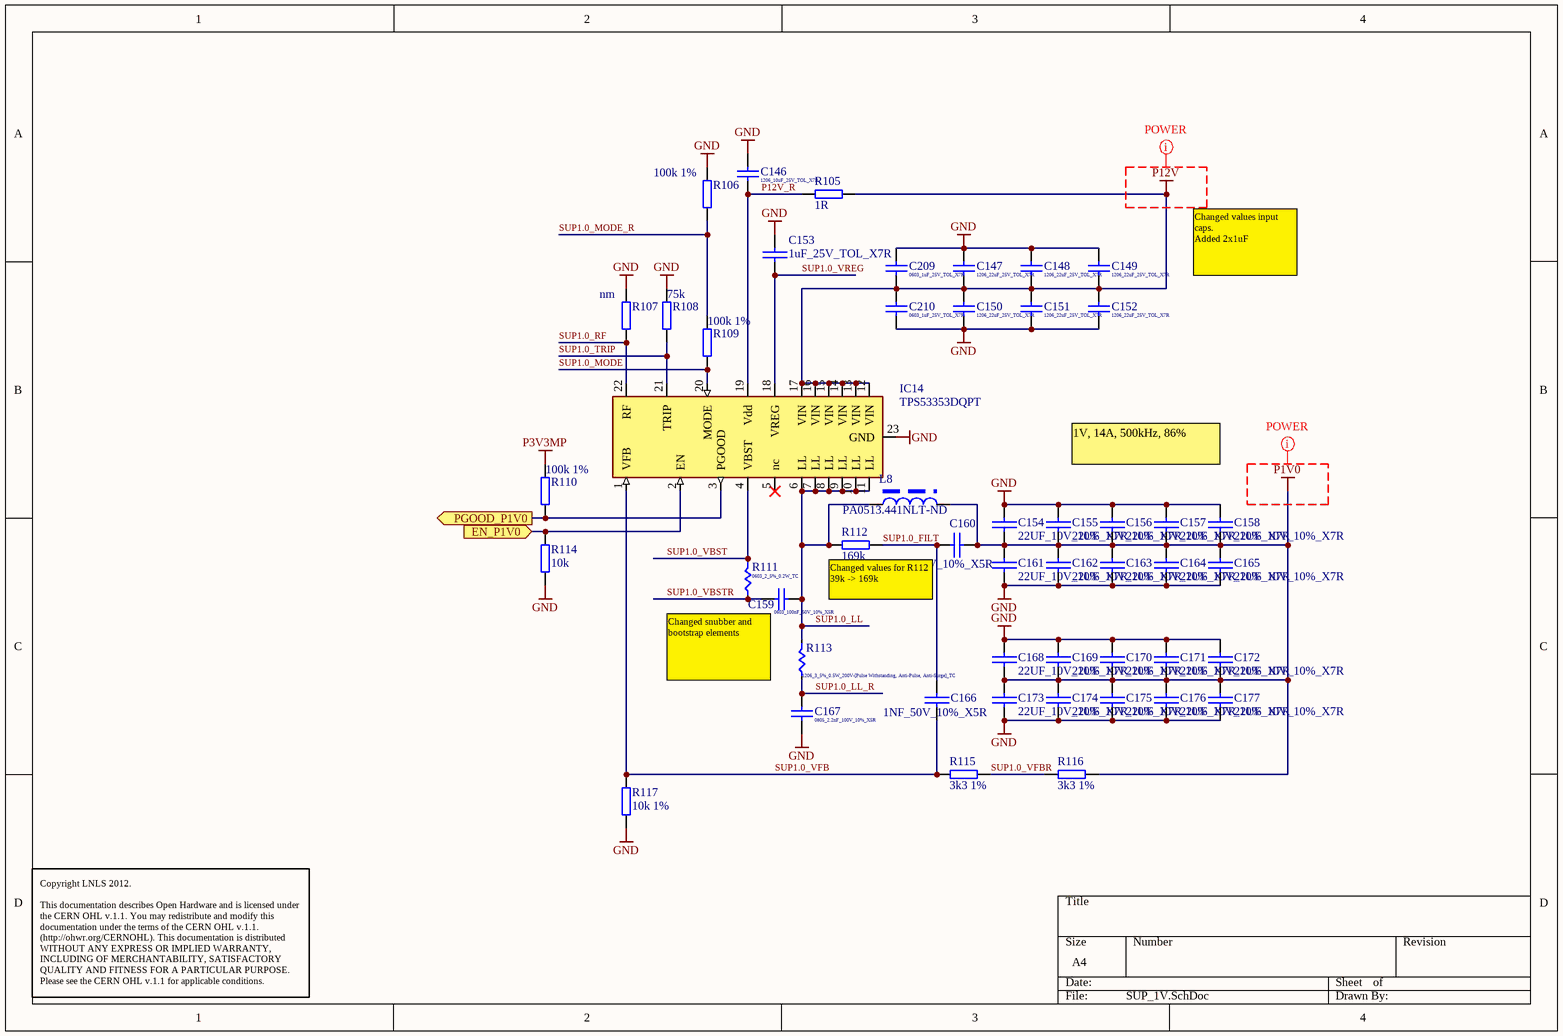
[diagram p25: SUP_1V.SchDoc]

### Parts
C146  1206_10uF_25V_TOL_X7R  [CAPC3225X140N]
C147  1206_22uF_25V_TOL_X7R  [CAPC3225X140N]
C148  1206_22uF_25V_TOL_X7R  [CAPC3225X140N]
C149  1206_22uF_25V_TOL_X7R  [CAPC3225X140N]
C150  1206_22uF_25V_TOL_X7R  [CAPC3225X140N]
C151  1206_22uF_25V_TOL_X7R  [CAPC3225X140N]
C152  1206_22uF_25V_TOL_X7R  [CAPC3225X140N]
C153  1uF_25V_TOL_X7R  [0603C]
C154  22UF_10V_10%_X7R  [1206C]
C155  22UF_10V_10%_X7R  [1206C]
C156  22UF_10V_10%_X7R  [1206C]
C157  22UF_10V_10%_X7R  [1206C]
C158  22UF_10V_10%_X7R  [1206C]
C159  0603_100nF_50V_10%_X5R  [CAPC1608X90N]
C160  22NF_50V_10%_X5R  [0402C]
C161  22UF_10V_10%_X7R  [1206C]
C162  22UF_10V_10%_X7R  [1206C]
C163  22UF_10V_10%_X7R  [1206C]
C164  22UF_10V_10%_X7R  [1206C]
C165  22UF_10V_10%_X7R  [1206C]
C166  1NF_50V_10%_X5R  [0402C]
C167  0805_2.2nF_100V_10%_X5R  [CAPC2012X140N]
C168  22UF_10V_10%_X7R  [1206C]
C169  22UF_10V_10%_X7R  [1206C]
C170  22UF_10V_10%_X7R  [1206C]
C171  22UF_10V_10%_X7R  [1206C]
C172  22UF_10V_10%_X7R  [1206C]
C173  22UF_10V_10%_X7R  [1206C]
C174  22UF_10V_10%_X7R  [1206C]
C175  22UF_10V_10%_X7R  [1206C]
C176  22UF_10V_10%_X7R  [1206C]
C177  22UF_10V_10%_X7R  [1206C]
C209  0603_1uF_25V_TOL_X7R  [CAPC1608X90N]
C210  0603_1uF_25V_TOL_X7R  [CAPC1608X90N]
IC14  TPS53353DQPT  [LCCS50P600X500X150-22N]
L8  PA0513.441NLT-ND  [IND_PA0513]
R105  1R  [0603R]
R106  100k 1%  [0603R]
R107  nm  [0603R]
R108  75k  [0603R]
R109  100k 1%  [0603R]
R110  100k 1%  [0603R]
R111  0603_2_5%_0.2W_TC  [RESC1608X64N]
R112  169k  [0603R]
R113  1206_3_5%_0.5W_200V-[Pulse Withstanding, Anti-Pulse, Anti-Surge]_TC  [RESC3216X80N]
R114  10k  [0402R]
R115  3k3 1%  [0603R]
R116  3k3 1%  [0603R]
R117  10k 1%  [0603R]

### Ports
EN_P1V0 (in), PGOOD_P1V0 (out)

### Nets
GND: C146.2 C147.2 C148.2 C149.2 C150.1 C151.1 C152.1 C153.1 C154.1 C155.1 C156.1 C157.1 C158.1 C161.2 C162.2 C163.2 C164.2 C165.2 C167.1 C168.1 C169.1 C170.1 C171.1 C172.1 C173.2 C174.2 C175.2 C176.2 C177.2 C209.2 C210.1 IC14.23(GND) R106.2 R107.2 R108.2 R114.1 R117.2
P1V0: C154.2 C155.2 C156.2 C157.2 C158.2 C160.2 C161.1 C162.1 C163.1 C164.1 C165.1 C168.2 C169.2 C170.2 C171.2 C172.2 C173.1 C174.1 C175.1 C176.1 C177.1 L8.2 R116.2
P3V3MP: R110.2
P12V: C147.1 C148.1 C149.1 C150.2 C151.2 C152.2 C209.1 C210.2 IC14.12(VIN) IC14.13(VIN) IC14.14(VIN) IC14.15(VIN) IC14.16(VIN) IC14.17(VIN) R105.1
P12V_R: C146.1 IC14.19(Vdd) R105.2
SUP1.0_FILT: C160.1 C166.2 R112.1
SUP1.0_LL: C159.1 IC14.6(LL) IC14.7(LL) IC14.8(LL) IC14.9(LL) IC14.10(LL) IC14.11(LL) L8.1 R112.2 R113.1(+)
SUP1.0_LL_R: C167.2 R113.2(-)
SUP1.0_MODE: IC14.20(MODE) R109.1
SUP1.0_MODE_R: R106.1 R109.2
SUP1.0_RF: IC14.22(RF) R107.1
SUP1.0_TRIP: IC14.21(TRIP) R108.1
SUP1.0_VBST: IC14.4(VBST) R111.1(+)
SUP1.0_VBSTR: C159.2 R111.2(-)
SUP1.0_VFB: C166.1 IC14.1(VFB) R115.1 R117.1
SUP1.0_VFBR: R115.2 R116.1
SUP1.0_VREG: C153.2 IC14.18(VREG)
NetIC14_2: IC14.2(EN) R114.2 ; port EN_P1V0
NetIC14_3: IC14.3(PGOOD) R110.1 ; port PGOOD_P1V0

Not connected (* = marked no-connect by the designer): IC14 5(nc)*

### Layout directives
net class POWER: P1V0, P12V

### Notes on the sheet
- Changed values input caps.
  Added 2x1uF
- 1V, 14A, 500kHz, 86%
- Changed values for R112 39k -> 169k
- Changed snubber and bootstrap elements
- Copyright LNLS 2012.
  This documentation describes Open Hardware and is licensed under the CERN OHL v.1.1. You may redistribute and modify this documentation under the terms of the CERN OHL v.1.1. (http://ohwr.org/CERNOHL). This documentation is distributed WITHOUT ANY EXPRESS OR IMPLIED WARRANTY, INCLUDING OF MERCHANTABILITY, SATISFACTORY QUALITY AND FITNESS FOR A PARTICULAR PURPOSE. Please see the CERN OHL v.1.1 for applicable conditions.

### Library data of the parts
C146-C152 = Ceramic_1206: MiscInfo: Biggest Cern Footprint [max height]; Document Name: SUP_1V.SchDoc; Part Number: Ceramic_1206; FootprintSizeX (mm): 4.65; FootprintSizeY (mm): 2.3; FootprintRectangleArea (mm): 10.7; Thickness (Max) (mm): 1.8; FootprintAlias: 1206
C153 = CAP_SMD_0603: Capacitor SMD; Supplier 1: Digi-Key; Supplier Part Number 1: 490-1524-2-ND
C154-C158 C161-C165 C168-C177 = CAP_SMD_1206: Capacitor SMD; Supplier 1: Newark; Supplier Part Number 1: 90R7810
C159 C209 C210 = Ceramic_0603: MiscInfo: Biggest Cern Footprint [max height]; Document Name: SUP_1V.SchDoc; Part Number: Ceramic_0603; FootprintSizeX (mm): 3; FootprintSizeY (mm): 1.5; FootprintRectangleArea (mm): 4.5; Thickness (Max) (mm): 0.9; FootprintAlias: 0603
C160 C166 = CAP_SMD_0402: Capacitor SMD; Supplier 1: Newark; Supplier Part Number 1: 14T3275
C167 = Ceramic_0805: MiscInfo: Biggest Cern Footprint [max height]; Document Name: SUP_1V.SchDoc; Part Number: Ceramic_0805; FootprintSizeX (mm): 3.5; FootprintSizeY (mm): 2; FootprintRectangleArea (mm): 7; Thickness (Max) (mm): 1.4; FootprintAlias: 0805
IC14 = PM_TPS53353: High-Efficiency 20-A Synchronous Buck Converter with Eco-mode™; Supplier 1: Digi-Key; Supplier Part Number 1: 296-29490-1-ND
L8 = L_POWER_PA1513_440nH: 440nH, 30A, 0.32mOhm; Supplier 1: Mouser; Supplier Part Number 1: 673-PA0513.441NLT
R105-R110 R112 R115-R117 = RES_0603: SMD Resistor; Supplier 1: Newark; Supplier Part Number 1: 39K0073
R111 = SMT_0603: MiscInfo: Biggest Cern Footprint [max height]; Document Name: SUP_1V.SchDoc; Part Number: SMT_0603; FootprintSizeX (mm): 3; FootprintSizeY (mm): 1.5; FootprintRectangleArea (mm): 4.5; Thickness (Max) (mm): 0.64; FootprintAlias: 0603
R113 = SMT_1206: MiscInfo: Biggest Cern Footprint [max height]; Document Name: SUP_1V.SchDoc; Part Number: SMT_1206; FootprintSizeX (mm): 4.8; FootprintSizeY (mm): 2.4; FootprintRectangleArea (mm): 11.52; Thickness (Max) (mm): 0.8; FootprintAlias: 1206
R114 = RES_0402: SMD Resistor; Supplier 1: Newark; Supplier Part Number 1: 59M6691

## Sheet SUP_2.5_FMC.SchDoc
size A4; DocumentNumber: 26; SheetNumber: 26; SheetTotal: 30
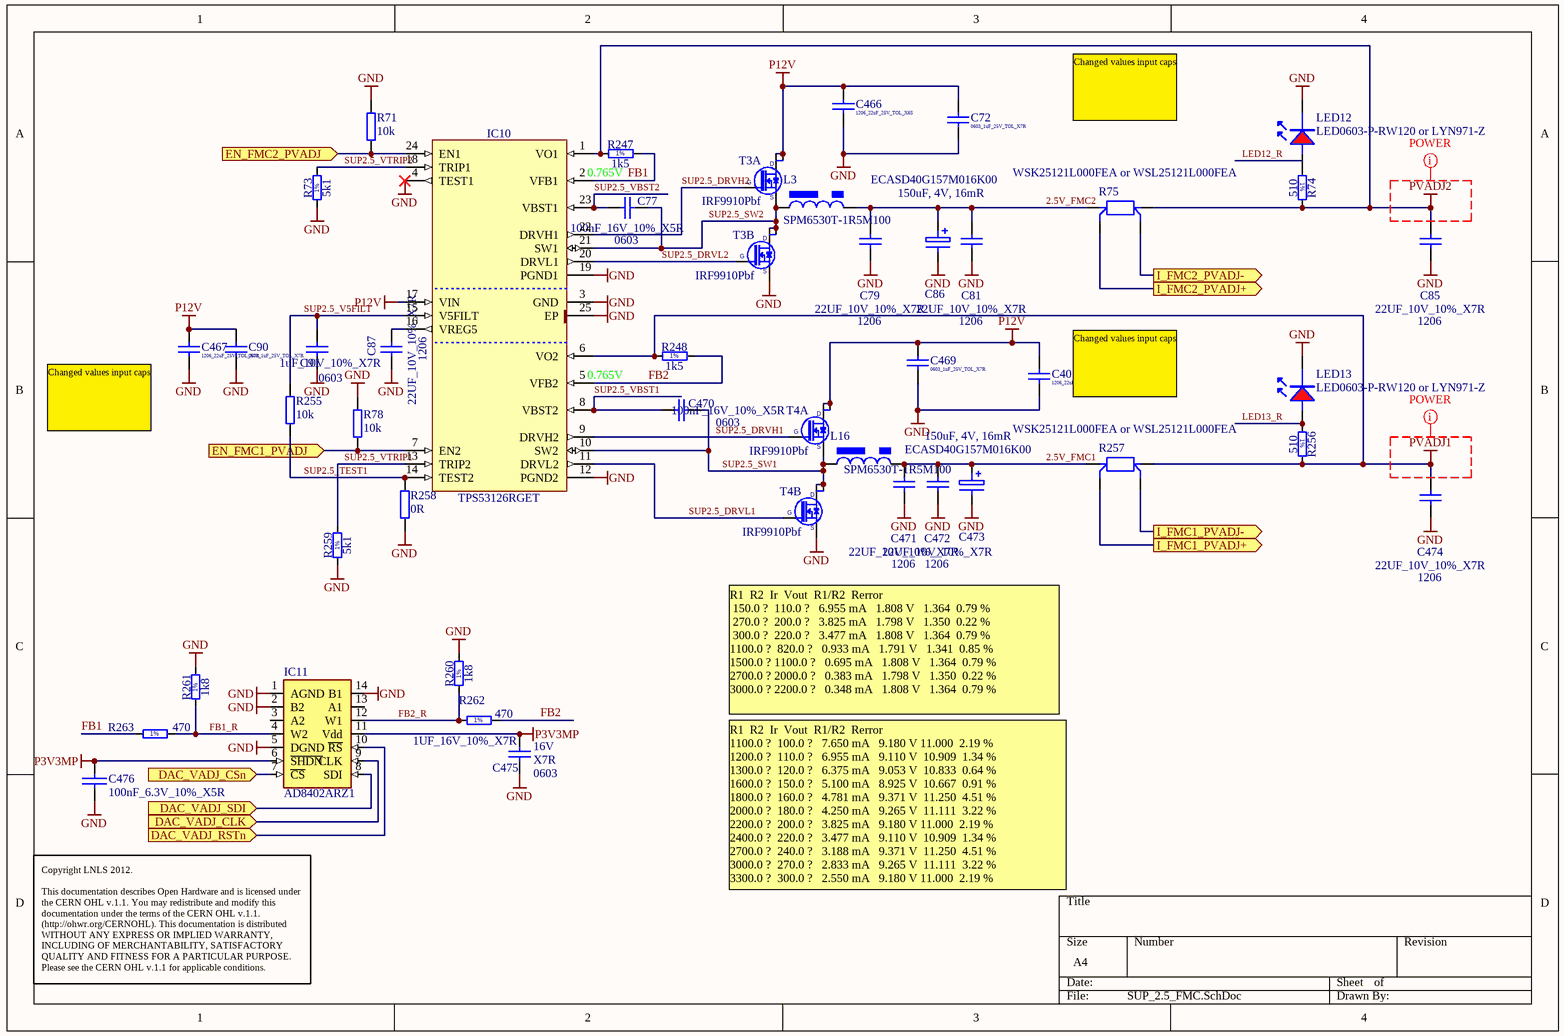
[diagram p26: SUP_2.5_FMC.SchDoc]

### Parts
C40  1206_22uF_25V_TOL_X6S  [CAPC3225X140N]
C72  0603_1uF_25V_TOL_X7R  [CAPC1608X90N]
C77  100nF_16V_10%_X5R  Case: 0603  [0402C]
C79  22UF_10V_10%_X7R  Case: 1206  [1206C]
C81  22UF_10V_10%_X7R  Case: 1206  [1206C]
C85  22UF_10V_10%_X7R  Case: 1206  [1206C]
C86  ECASD40G157M016K00  value 150uF, 4V, 16mR  [2917_POLY]
C87  22UF_10V_10%_X7R  Case: 1206  [1206C]
C90  0603_1uF_25V_TOL_X7R  [CAPC1608X90N]
C91  1uF_10V_10%_X7R  Case: 0603  [0603C]
C466  1206_22uF_25V_TOL_X6S  [CAPC3225X140N]
C467  1206_22uF_25V_TOL_X7R  [CAPC3225X140N]
C469  0603_1uF_25V_TOL_X7R  [CAPC1608X90N]
C470  100nF_16V_10%_X5R  Case: 0603  [0402C]
C471  22UF_10V_10%_X7R  Case: 1206  [1206C]
C472  22UF_10V_10%_X7R  Case: 1206  [1206C]
C473  ECASD40G157M016K00  value 150uF, 4V, 16mR  [2917_POLY]
C474  22UF_10V_10%_X7R  Case: 1206  [1206C]
C475  1UF_16V_10%_X7R  Voltage: 16V  TC: X7R  Case: 0603  [0603C]
C476  100nF_6.3V_10%_X5R  [0201C]
IC10  TPS53126RGET  [QFN50P400X400X100-25N-S255]
IC11  AD8402ARZ1  [SO-14]
L3  SPM6530T-1R5M100  [IND_TDK_SPM6530]
L16  SPM6530T-1R5M100  [IND_TDK_SPM6530]
LED12  LED0603-P-RW120 or LYN971-Z  [led_0603R]
LED13  LED0603-P-RW120 or LYN971-Z  [led_0603R]
R71  10k  [0402R]
R73  5k1  [0603R]
R74  510  [0603R]
R75  WSK25121L000FEA or WSL25121L000FEA  [RES_WSK2512]
R78  10k  [0402R]
R247  1k5  [RESC1608X55N]
R248  1k5  [RESC1608X55N]
R255  10k  [0402R]
R256  510  [0603R]
R257  WSK25121L000FEA or WSL25121L000FEA  [RES_WSK2512]
R258  0R  [0402R]
R259  5k1  [0603R]
R260  1k8  [RESC1608X55N]
R261  1k8  [RESC1608X55N]
R262  470  [RESC1608X55N]
R263  470  [RESC1608X55N]
T3  IRF9910Pbf  [SOIC127P600X175-8N]  (parts A,B of 2)
T4  IRF9910Pbf  [SOIC127P600X175-8N]  (parts A,B of 2)

### Ports
DAC_VADJ_CLK (in), DAC_VADJ_CSn (in), DAC_VADJ_RSTn (in), DAC_VADJ_SDI (in), EN_FMC1_PVADJ (in), EN_FMC2_PVADJ (in), I_FMC1_PVADJ+ (out), I_FMC1_PVADJ- (out), I_FMC2_PVADJ+ (out), I_FMC2_PVADJ- (out)

### Nets
GND: C40.1 C72.1 C79.2 C81.2 C85.2 C86.2 C87.1 C90.1 C91.1 C466.1 C467.1 C469.1 C471.2 C472.2 C473.2 C474.2 C475.1 C476.2 IC10.3(GND) IC10.4(TEST1) IC10.12(PGND2) IC10.19(PGND1) IC10.25(EP) IC11.1(AGND) IC11.2(B2) IC11.5(DGND) IC11.14(B1) LED12.K LED13.K R71.2 R73.1 R78.2 R258.1 R259.1 R260.2 R261.2 T3.1(S) T4.1(S)
P3V3MP: C475.2 C476.1 IC11.6(~{SHDN}) IC11.11(Vdd)
P12V: C40.2 C72.2 C90.2 C466.2 C467.2 C469.2 IC10.17(VIN) T3.5(D) T3.6(D) T4.5(D) T4.6(D)
PVADJ1: C474.1 IC10.6(VO2) R248.1 R256.2 R257.2
PVADJ2: C85.1 IC10.1(VO1) R74.2 R75.2 R247.1
2.5V_FMC1: C471.1 C472.1 C473.1 L16.2 R257.1
2.5V_FMC2: C79.1 C81.1 C86.1 L3.2 R75.1
FB1: IC10.2(VFB1) R247.2 R263.1
FB1_R: IC11.4(W2) R261.1 R263.2
FB2: IC10.5(VFB2) R248.2 R262.2
FB2_R: IC11.12(W1) R260.1 R262.1
LED13_R: LED13.A R256.1
SUP2.5_DRVH1: IC10.9(DRVH2) T4.4(G)
SUP2.5_DRVH2: IC10.22(DRVH1) T3.4(G)
SUP2.5_DRVL1: IC10.11(DRVL2) T4.2(G)
SUP2.5_DRVL2: IC10.20(DRVL1) T3.2(G)
SUP2.5_SW1: C470.1 IC10.10(SW2) L16.1 T4.3(S) T4.7(D) T4.8(D)
SUP2.5_SW2: C77.1 IC10.21(SW1) L3.1 T3.3(S) T3.7(D) T3.8(D)
SUP2.5_TEST1: IC10.14(TEST2) R255.1 R258.2
SUP2.5_V5FILT: C91.2 IC10.15(V5FILT) R255.2
SUP2.5_VBST1: C470.2 IC10.8(VBST2)
SUP2.5_VBST2: C77.2 IC10.23(VBST1)
SUP2.5_VTRIP1: IC10.13(TRIP2) R259.2
SUP2.5_VTRIP2: IC10.18(TRIP1) R73.2
NetC87_2: C87.2 IC10.16(VREG5)
NetIC10_7: IC10.7(EN2) R78.1 ; port EN_FMC1_PVADJ
NetIC10_24: IC10.24(EN1) R71.1 ; port EN_FMC2_PVADJ
NetIC11_7: IC11.7(~{CS}) ; port DAC_VADJ_CSn
NetIC11_8: IC11.8(SDI) ; port DAC_VADJ_SDI
NetIC11_9: IC11.9(CLK) ; port DAC_VADJ_CLK
NetIC11_10: IC11.10(~{RS}) ; port DAC_VADJ_RSTn
NetLED12_A: LED12.A R74.1
NetR75_1a: R75.1a ; port I_FMC2_PVADJ+
NetR75_2a: R75.2a ; port I_FMC2_PVADJ-
NetR257_1a: R257.1a ; port I_FMC1_PVADJ+
NetR257_2a: R257.2a ; port I_FMC1_PVADJ-

Not connected (* = marked no-connect by the designer): IC11 3(A2) 13(A1)

### Layout directives
net class POWER: PVADJ1, PVADJ2

### Notes on the sheet
- Changed values input caps
- 0.765V
- (near IC10) 0.765V
- (near C467) Changed values input caps
- (near C40) Changed values input caps
- R1 	R2 	Ir 	Vout 	R1/R2 	Rerror
  150.0 ?	 110.0 ?	  6.955 mA	  1.808 V	  1.364	 0.79 %
  270.0 ?	 200.0 ?	  3.825 mA	  1.798 V	  1.350	 0.22 %
  300.0 ?	 220.0 ?	  3.477 mA	  1.808 V	  1.364	 0.79 %
  1100.0 ?	 820.0 ?	  0.933 mA	  1.791 V	  1.341	 0.85 %
  1500.0 ?	1100.0 ?	  0.695 mA	  1.808 V	  1.364	 0.79 %
  2700.0 ?	2000.0 ?	  0.383 mA	  1.798 V	  1.350	 0.22 %
  3000.0 ?	2200.0 ?	  0.348 mA	  1.808 V	  1.364	 0.79 %
- R1 	R2 	Ir 	Vout 	R1/R2 	Rerror
  1100.0 ?	 100.0 ?	  7.650 mA	  9.180 V	11.000	 2.19 %
  1200.0 ?	 110.0 ?	  6.955 mA	  9.110 V	 10.909	 1.34 %
  1300.0 ?	 120.0 ?	  6.375 mA	  9.053 V	 10.833	 0.64 %
  1600.0 ?	 150.0 ?	  5.100 mA	  8.925 V	 10.667	 0.91 %
  1800.0 ?	 160.0 ?	  4.781 mA	  9.371 V	 11.250	 4.51 %
  2000.0 ?	 180.0 ?	  4.250 mA	  9.265 V	 11.111	 3.22 %
  2200.0 ?	 200.0 ?	  3.825 mA	  9.180 V	11.000	 2.19 %
  2400.0 ?	 220.0 ?	  3.477 mA	  9.110 V	 10.909	 1.34 %
  2700.0 ?	 240.0 ?	  3.188 mA	  9.371 V	 11.250	 4.51 %
  3000.0 ?	 270.0 ?	  2.833 mA	  9.265 V	 11.111	 3.22 %
  3300.0 ?	 300.0 ?	  2.550 mA	  9.180 V	11.000	 2.19 %
- Copyright LNLS 2012.
  This documentation describes Open Hardware and is licensed under the CERN OHL v.1.1. You may redistribute and modify this documentation under the terms of the CERN OHL v.1.1. (http://ohwr.org/CERNOHL). This documentation is distributed WITHOUT ANY EXPRESS OR IMPLIED WARRANTY, INCLUDING OF MERCHANTABILITY, SATISFACTORY QUALITY AND FITNESS FOR A PARTICULAR PURPOSE. Please see the CERN OHL v.1.1 for applicable conditions.
- (in symbol R0402_510R_1%_0.0625W_100PPM) 1%
- (in symbol R0603_1K5_1%_0.1W_100PPM) 1%
- (in symbol R0603_5K1_1%_0.1W_100PPM) 1%
- (in symbol R0603_470R_1%_0.1W_100PPM) 1%
- (in symbol R0603_910R_1%_0.1W_100PPM) 1%

### Library data of the parts
C40 C466 C467 = Ceramic_1206: MiscInfo: Biggest Cern Footprint [max height]; Document Name: SUP_2.5_FMC.SchDoc; Part Number: Ceramic_1206; FootprintSizeX (mm): 4.65; FootprintSizeY (mm): 2.3; FootprintRectangleArea (mm): 10.7; Thickness (Max) (mm): 1.8; FootprintAlias: 1206
C72 C90 C469 = Ceramic_0603: MiscInfo: Biggest Cern Footprint [max height]; Document Name: SUP_2.5_FMC.SchDoc; Part Number: Ceramic_0603; FootprintSizeX (mm): 3; FootprintSizeY (mm): 1.5; FootprintRectangleArea (mm): 4.5; Thickness (Max) (mm): 0.9; FootprintAlias: 0603
C77 C470 = CC0603_100NF_50V_10%_X7R: as C113 on sheet SUP_3.3_FMC; Part Number: CC0603_100NF_50V_10%_X7R; Component Kind: Standard; Component Type: Standard; Footprint: CAPC1608X87N; Pin Count: 2; Status: Preferred; Manufacturer Part Number: CC0603_100NF_50V_10%_X7R; Mounted: Yes; Socket: No; SMD: Yes; Manufacturer1 Example: PHYCOMP; Manufacturer1 ComponentHeight: 0.87mm; HelpURL: \\cern.ch\dfs\Applications\Altium\Datasheets\CC0603_X7R_PHYCOMP.pdf; Author: CERN DEM JLC; CreateDate: 2007-12-03; LatestRevisionDate: 2007-12-03
C79 C81 C85 C87 C471 C472 C474 = CC1206_22UF_10V_10%_X7R: as C116 on sheet SUP_3.3_FMC; Part Number: CC1206_22UF_10V_10%_X7R; Component Kind: Standard; Component Type: Standard; Footprint: CAPC3216X180N; Pin Count: 2; Status: Preferred; Manufacturer Part Number: CC1206_22UF_10V_10%_X7R; Mounted: Yes; Socket: No; SMD: Yes; Manufacturer1 Example: MURATA; Manufacturer1 ComponentHeight: 1.8mm; HelpURL: \\cern.ch\dfs\Applications\Altium\Datasheets\CC1206_X7R_MURATA_GRM-HI-CAP.pdf; Author: CERN DEM JLC; CreateDate: 08/06/2010; LatestRevisionDate: 08/06/2010
C86 C473 = CAP_POLYMER_SMDD: POLY, 150uF, 4V, ESR: 16mR
C91 = CC0603_1UF_16V_10%_X7R: as C127 on sheet SUP_3.3_FMC; Part Number: CC0603_1UF_16V_10%_X7R; Component Kind: Standard; Component Type: Standard; Footprint: CAPC1608X87N; Pin Count: 2; Status: Preferred; Manufacturer Part Number: CC0603_1uF_16V_10%_X7R; Mounted: Yes; Socket: No; SMD: Yes; Manufacturer1 Example: PHYCOMP; Manufacturer1 ComponentHeight: 0.87mm; HelpURL: \\cern.ch\dfs\Applications\Altium\Datasheets\CC0805_X5R_PHYCOMP_HC.pdf; Author: CERN DEM JLC; CreateDate: 03/12/2007; LatestRevisionDate: 03/12/2007
C475 = CC0603_1UF_16V_10%_X7R: Non-polarised capacitor; Part Description: SMD Multilayer Chip Ceramic Capacitor; Manufacturer: GENERIC; Manufacturer1 Part Number: 223824613663; Value: 1uF; Tolerance: ±10%; Table: Capacitors SMD; Part Number: CC0603_1UF_16V_10%_X7R; Component Kind: Standard; Component Type: Standard; Footprint: CAPC1608X87N; Pin Count: 2; Status: Preferred; Manufacturer Part Number: CC0603_1uF_16V_10%_X7R; Mounted: Yes; Socket: No; SMD: Yes; Manufacturer1 Example: PHYCOMP; Manufacturer1 ComponentHeight: 0.87mm; HelpURL: \\cern.ch\dfs\Applications\Altium\Datasheets\CC0805_X5R_PHYCOMP_HC.pdf; Author: CERN DEM JLC; CreateDate: 12/3/2007; LatestRevisionDate: 12/3/2007
C476 = CAP_SMD_0201: Capacitor SMD
IC10 = TPS53126RGET: as IC12 on sheet SUP_3.3_FMC; Part Number: TPS53126RGET; Component Kind: Standard; Component Type: Standard; Device: TPS53126RGET; PackageDescription: QFN,0.50mm pitch,square;6 pin X 6 pin,4.15mm X 4.15mm X 1.00mm H body (w/thermal tab 2.55 X 2.55mm),  IPC Medium Density; Part Description: Dual Synchronous Step-Down Controller For Low Voltage Power Rails; Manufacturer Part Number: TPS53126RGET; Pin Count: 25; Case: QFN24; Mounted: Yes; Socket: No; SMD: Yes; ComponentHeight: 1.0mm; Author: CERN DEM JLC; HelpURL: \\cern.ch\dfs\Applications\Altium\Datasheets\TPS53126RGET.pdf; CreateDate: 2010-08-26; LatestRevisionDate: 2010-08-26
IC11 = DAC_AD8402: 1k dual digital potentiometer; Supplier 1: Digi-Key; Supplier Part Number 1: AD8402ARZ100-ND
L3 L16 = L_POWER_SPM6530T: 1.5uH, 20%, 10mR, 11.5A; Supplier 1: Arrow; Supplier Part Number 1: 51419938S48550N1165
LED12 LED13 = LED_0603R: LED 0603 red; Supplier 1: Newark; Supplier Part Number 1: 22M3004; Supplier 2: Newark; Supplier Part Number 2: 20M0618
R71 R78 R255 R258 = RES_0402: SMD Resistor; Supplier 1: Newark; Supplier Part Number 1: 59M6691
R73 R259 = R0603_5K1_1%_0.1W_100PPM: as R87 on sheet SUP_3.3_FMC; Part Number: R0603_5K1_1%_0.1W_100PPM; Component Kind: Standard; Component Type: Standard; Footprint: RESC1608X55N; Pin Count: 2; Value: 5k1; Status: Preferred; Tolerance: ±1%; Manufacturer Part Number: R0603_5K1_1%_0.1W_100PPM; Case: 0603; Mounted: Yes; Socket: No; SMD: Yes; Manufacturer1 Example: NIC COMPONENT; Manufacturer1 ComponentHeight: 0.55mm; HelpURL: \\cern.ch\dfs\Applications\Altium\Datasheets\R0603_NIC_NRC.pdf; Author: CERN DEM JLC; CreateDate: 2007-12-03; LatestRevisionDate: 2008-03-13
R74 R256 = R0402_510R_1%_0.0625W_100PPM: as R88 on sheet SUP_3.3_FMC; Part Number: R0402_510R_1%_0.0625W_100PPM; Component Kind: Standard; Component Type: Standard; Footprint: RESC1005X40N; Pin Count: 2; Value: 510; Status: Not recommended; Power: 0.0625W; Tolerance: ±1%; Manufacturer Part Number: R0402_510R_1%_0.0625W_100PPM; Case: 0402; Mounted: Yes; Socket: No; SMD: Yes; Manufacturer1 Example: PHYCOMP; Manufacturer1 ComponentHeight: 0.4mm; HelpURL: \\cern.ch\dfs\Applications\Altium\Datasheets\R0402_Phycomp_RC0402.pdf; Author: CERN DEM JLC; CreateDate: 2007-12-03; LatestRevisionDate: 2008-03-13
R75 R257 = RES_POW_Kelvin: RESISTOR, METAL STRIP, 0.001 OHM 1%
R247 R248 = R0603_1K5_1%_0.1W_100PPM: Resistor - 1%; Part Description: General Purpose Thick Film Chip Resistor; Manufacturer: GENERIC; Manufacturer1 Part Number: NRC06F1501TRF; Power: 0.1W; TC: ±100ppm/°C; Table: Resistors SMD; Part Number: R0603_1K5_1%_0.1W_100PPM; Component Kind: Standard; Component Type: Standard; Pin Count: 2; Value: 1k5; Status: Preferred; Tolerance: ±1%; Manufacturer Part Number: R0603_1K5_1%_0.1W_100PPM; Case: 0603; Mounted: Yes; Socket: No; SMD: Yes; Manufacturer1 Example: NIC COMPONENT; Manufacturer1 ComponentHeight: 0.55mm; HelpURL: \\cern.ch\dfs\Applications\Altium\Datasheets\R0603_NIC_NRC.pdf; Author: CERN DEM JLC; CreateDate: 2007-12-03; LatestRevisionDate: 2008-03-13
R260 R261 = R0603_910R_1%_0.1W_100PPM: Resistor - 1%; Part Description: General Purpose Thick Film Chip Resistor; Manufacturer: GENERIC; Manufacturer1 Part Number: NRC06F9100TRF; Value: 910; Power: 0.1W; TC: ±100ppm/°C; Table: Resistors SMD; Part Number: R0603_910R_1%_0.1W_100PPM; Component Kind: Standard; Component Type: Standard; Pin Count: 2; Status: Preferred; Tolerance: ±1%; Manufacturer Part Number: R0603_910R_1%_0.1W_100PPM; Case: 0603; Mounted: Yes; Socket: No; SMD: Yes; Manufacturer1 Example: NIC COMPONENT; Manufacturer1 ComponentHeight: 0.55mm; HelpURL: \\cern.ch\dfs\Applications\Altium\Datasheets\R0603_NIC_NRC.pdf; Author: CERN DEM JLC; CreateDate: 2007-12-03; LatestRevisionDate: 2008-03-13
R262 R263 = R0603_470R_1%_0.1W_100PPM: Resistor - 1%; Part Description: General Purpose Thick Film Chip Resistor; Manufacturer: GENERIC; Manufacturer1 Part Number: NRC06F4700TRF; Power: 0.1W; TC: ±100ppm/°C; Table: Resistors SMD; Part Number: R0603_470R_1%_0.1W_100PPM; Component Kind: Standard; Component Type: Standard; Pin Count: 2; Value: 470; Status: Preferred; Tolerance: ±1%; Manufacturer Part Number: R0603_470R_1%_0.1W_100PPM; Case: 0603; Mounted: Yes; Socket: No; SMD: Yes; Manufacturer1 Example: NIC COMPONENT; Manufacturer1 ComponentHeight: 0.55mm; HelpURL: \\cern.ch\dfs\Applications\Altium\Datasheets\R0603_NIC_NRC.pdf; Author: CERN DEM JLC; CreateDate: 2007-12-03; LatestRevisionDate: 2008-03-13
T3 T4 = IRF9910Pbf: as T5 on sheet SUP_3.3_FMC; Part Number: IRF9910Pbf; Component Kind: Standard; Component Type: Standard; Device: IRF9910Pbf; PackageDescription: SOIC 8, Pitch 1.27mm - Body 4x5mm, IPC Medium Density; Manufacturer Part Number: IRF9910Pbf; Pin Count: 8; Case: DO8; Mounted: Yes; Socket: No; SMD: Yes; ComponentHeight: 1.75mm; HelpURL: \\cern.ch\dfs\Applications\Altium\Datasheets\IRF9910Pbf.pdf; Author: CERN DEM JLC; CreateDate: 2010-08-30; LatestRevisionDate: 2010-08-30

## Sheet UI_mon.SchDoc
size A4; DocumentNumber: 28; SheetNumber: 28; SheetTotal: 30
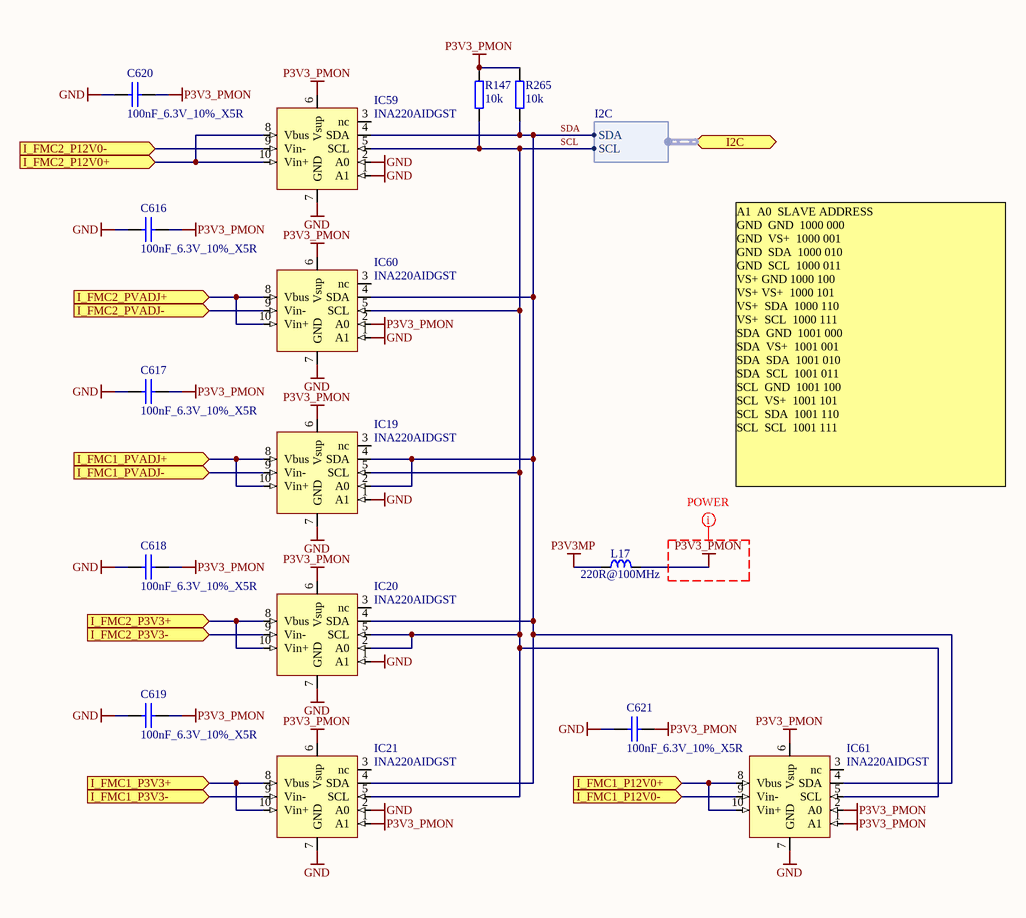
[diagram p27: UI_mon.SchDoc]

### Parts
C616  100nF_6.3V_10%_X5R  [0201C]
C617  100nF_6.3V_10%_X5R  [0201C]
C618  100nF_6.3V_10%_X5R  [0201C]
C619  100nF_6.3V_10%_X5R  [0201C]
C620  100nF_6.3V_10%_X5R  [0201C]
C621  100nF_6.3V_10%_X5R  [0201C]
IC19  INA220AIDGST  [msop10]
IC20  INA220AIDGST  [msop10]
IC21  INA220AIDGST  [msop10]
IC59  INA220AIDGST  [msop10]
IC60  INA220AIDGST  [msop10]
IC61  INA220AIDGST  [msop10]
L17  220R@100MHz  [0603L]
R147  10k  [0402R]
R265  10k  [0402R]

### Ports
I2C (harness I2C), I_FMC1_P3V3+ (in), I_FMC1_P3V3- (in), I_FMC1_P12V0+ (in), I_FMC1_P12V0- (in), I_FMC1_PVADJ+ (in), I_FMC1_PVADJ- (in), I_FMC2_P3V3+ (in), I_FMC2_P3V3- (in), I_FMC2_P12V0+ (in), I_FMC2_P12V0- (in), I_FMC2_PVADJ+ (in), I_FMC2_PVADJ- (in)

### Harnesses
I2C: SCL, SDA

### Nets
GND: C616.2 C617.2 C618.2 C619.2 C620.2 C621.2 IC19.1(A1) IC19.7(GND) IC20.1(A1) IC20.7(GND) IC21.2(A0) IC21.7(GND) IC59.1(A1) IC59.2(A0) IC59.7(GND) IC60.1(A1) IC60.7(GND) IC61.7(GND)
P3V3_PMON: C616.1 C617.1 C618.1 C619.1 C620.1 C621.1 IC19.6(Vsup) IC20.6(Vsup) IC21.1(A1) IC21.6(Vsup) IC59.6(Vsup) IC60.2(A0) IC60.6(Vsup) IC61.1(A1) IC61.2(A0) IC61.6(Vsup) L17.2 R147.2 R265.2
P3V3MP: L17.1
SCL: IC19.5(SCL) IC20.2(A0) IC20.5(SCL) IC21.5(SCL) IC59.5(SCL) IC60.5(SCL) IC61.5(SCL) R147.1 ; port I2C.SCL
SDA: IC19.2(A0) IC19.4(SDA) IC20.4(SDA) IC21.4(SDA) IC59.4(SDA) IC60.4(SDA) IC61.4(SDA) R265.1 ; port I2C.SDA
NetIC19_8: IC19.8(Vbus) IC19.10(Vin+) ; port I_FMC1_PVADJ+
NetIC19_9: IC19.9(Vin-) ; port I_FMC1_PVADJ-
NetIC20_8: IC20.8(Vbus) IC20.10(Vin+) ; port I_FMC2_P3V3+
NetIC20_9: IC20.9(Vin-) ; port I_FMC2_P3V3-
NetIC21_8: IC21.8(Vbus) IC21.10(Vin+) ; port I_FMC1_P3V3+
NetIC21_9: IC21.9(Vin-) ; port I_FMC1_P3V3-
NetIC59_8: IC59.8(Vbus) IC59.10(Vin+) ; port I_FMC2_P12V0+
NetIC59_9: IC59.9(Vin-) ; port I_FMC2_P12V0-
NetIC60_8: IC60.8(Vbus) IC60.10(Vin+) ; port I_FMC2_PVADJ+
NetIC60_9: IC60.9(Vin-) ; port I_FMC2_PVADJ-
NetIC61_8: IC61.8(Vbus) IC61.10(Vin+) ; port I_FMC1_P12V0+
NetIC61_9: IC61.9(Vin-) ; port I_FMC1_P12V0-

Not connected (* = marked no-connect by the designer): IC19 3(nc); IC20 3(nc); IC21 3(nc); IC59 3(nc); IC60 3(nc); IC61 3(nc)

### Layout directives
net class POWER: P3V3_PMON

### Notes on the sheet
- A1 	A0 	SLAVE ADDRESS
  GND 	GND 	1000 000
  GND 	VS+ 	1000 001
  GND 	SDA 	1000 010
  GND 	SCL 	1000 011
  VS+	GND	1000 100
  VS+	VS+ 	1000 101
  VS+ 	SDA 	1000 110
  VS+ 	SCL 	1000 111
  SDA 	GND 	1001 000
  SDA 	VS+ 	1001 001
  SDA 	SDA 	1001 010
  SDA 	SCL 	1001 011
  SCL 	GND 	1001 100
  SCL 	VS+ 	1001 101
  SCL 	SDA 	1001 110
  SCL 	SCL 	1001 111

### Library data of the parts
C616-C621 = CAP_SMD_0201: Capacitor SMD
IC19-IC21 IC59-IC61 = ADC_INA220: CURRENT/POWER MONITOR with Two-Wire Interface
L17 = IND0805_MURATA_BLM21PG221SN1D: Inductor; Part Description: SMD EMIFIL Suppression Chip Bead Ferrite; Manufacturer: MURATA; Power: 2A; Resistance: 0.05R; Tolerance: ±25%; Table: Inductors SMD; Part Number: IND0805_MURATA_BLM21PG221SN1D; Component Kind: Standard; Component Type: Standard; Footprint: INDC2012X105N; Pin Count: 2; Value: 220R@100MHz; Status: None; Manufacturer Part Number: BLM21PG221SN1D; Case: 0805; Mounted: Yes; Socket: No; SMD: Yes; ComponentHeight: 1.05mm; HelpURL: \\cern.ch\dfs\Applications\Altium\Datasheets\IND0402_MURATA_BLM21P.pdf; Author: CERN DEM JLC; CreateDate: 2010-01-25; LatestRevisionDate: 2010-01-25
R147 R265 = RES_0402: SMD Resistor; Supplier 1: Newark; Supplier Part Number 1: 59M6691